# EAGLE schematic v2.0 (EAGLE 8.2.2)

## Sheet 1 of 8: Digital
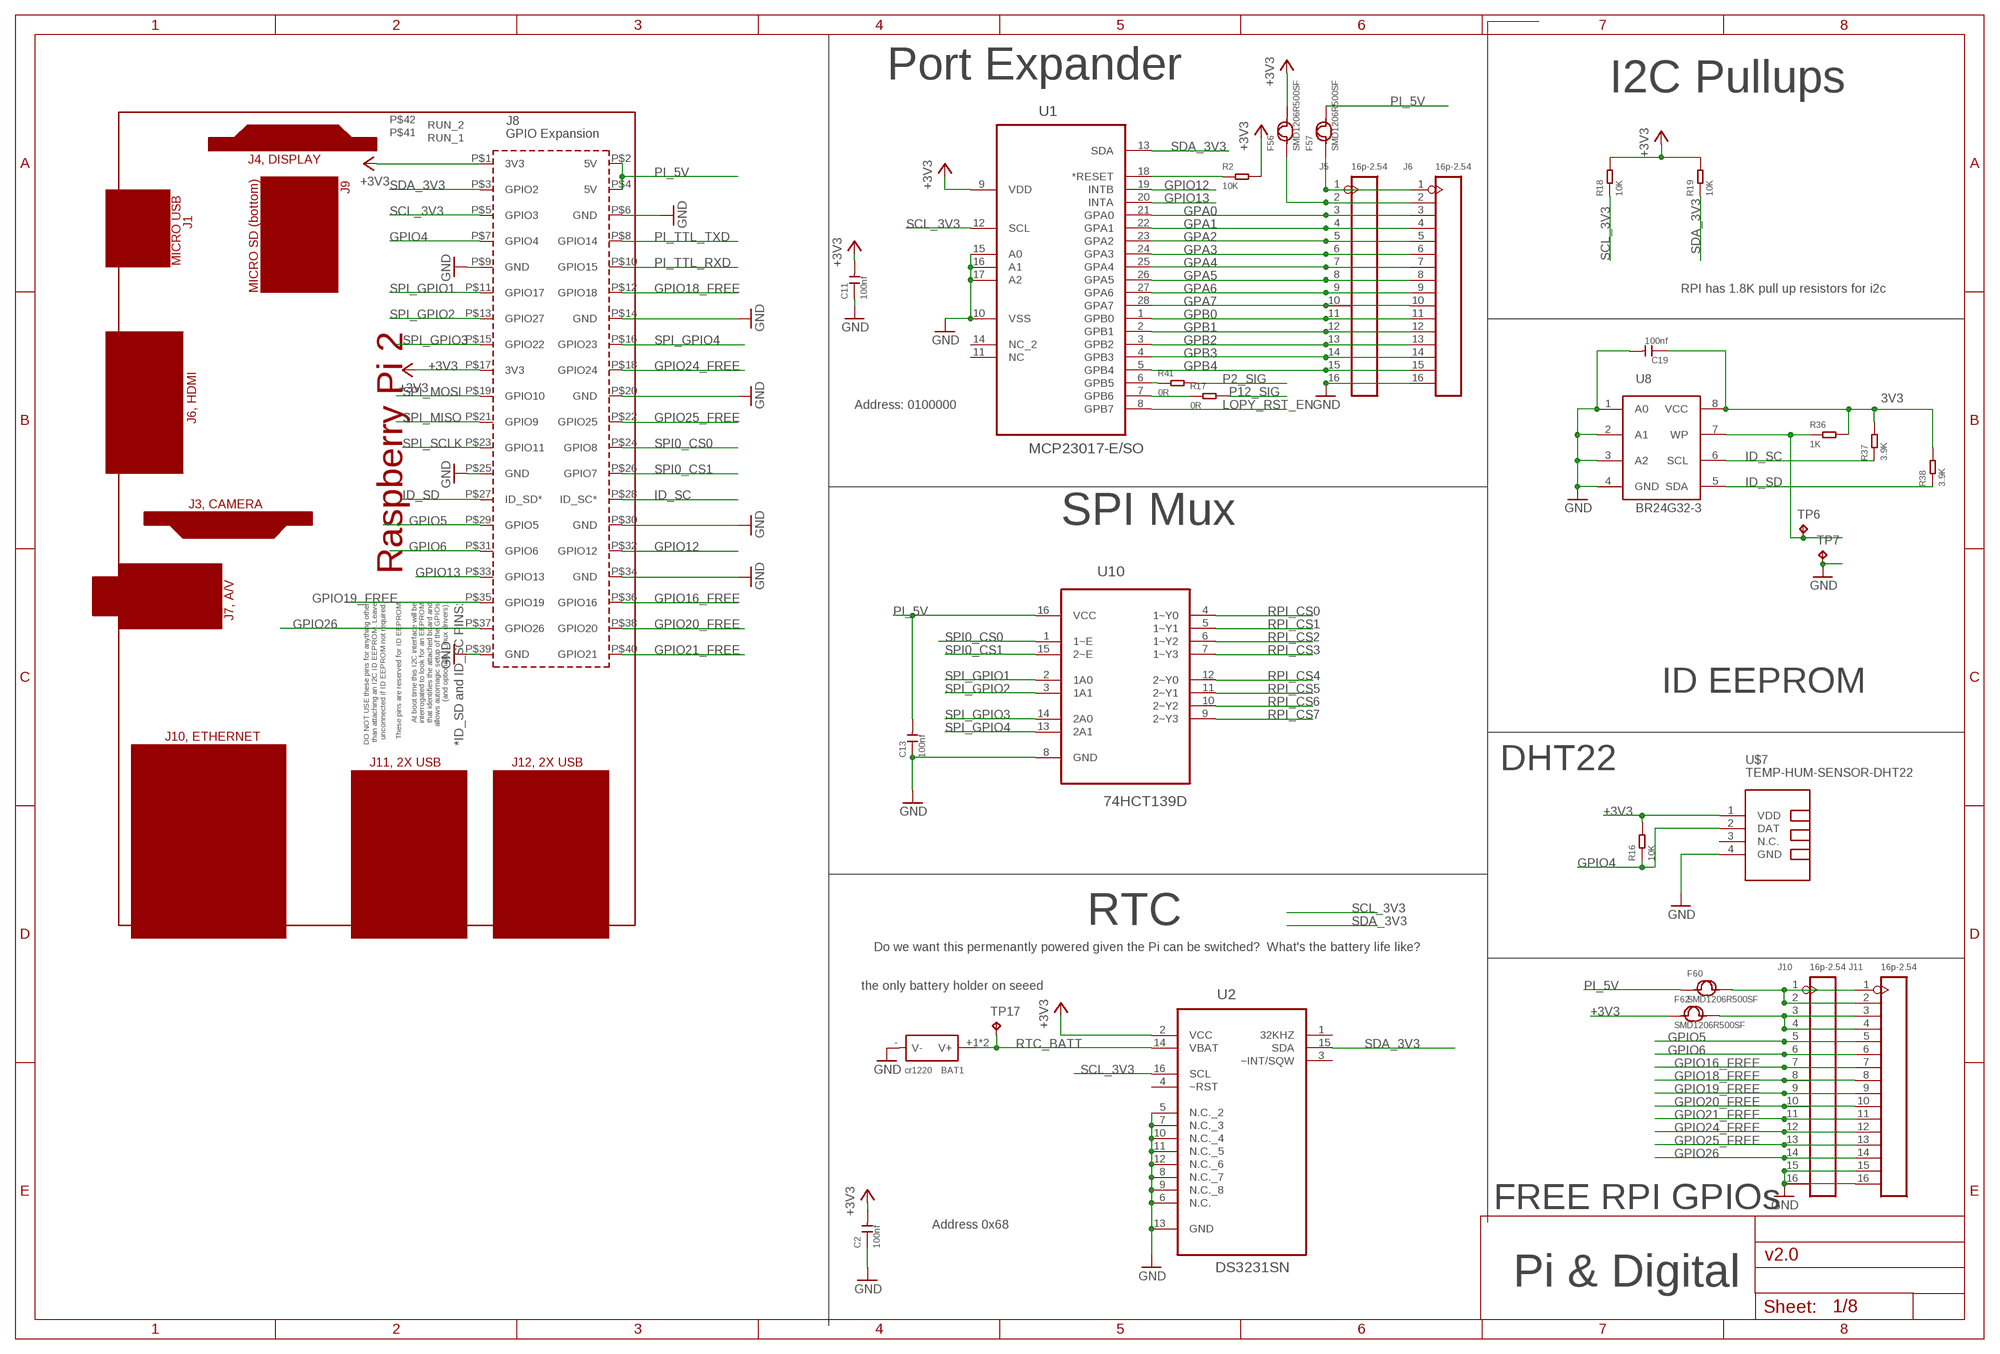
[diagram p0: schematic, sheet 1]

### Parts
BAT1  cr1220  DIP-BATTERY-CELL-HOLDER(1220)  [BAT2P-13.5-CR1220]
C2  100nf  CERAMIC-100NF-50V-10%-X7R(0603)  [C0603]
C11  100nf  CERAMIC-100NF-50V-10%-X7R(0603)  [C0603]
C13  100nf  CERAMIC-100NF-50V-10%-X7R(0603)  [C0603]
C19  100nf  CERAMIC-100NF-50V-10%-X7R(0603)  [C0603]
F56  SMD1206R500SF  SMD-PPTC-500MA(1206)  [F1206]
F57  SMD1206R500SF  SMD-PPTC-500MA(1206)  [F1206]
F60  SMD1206R500SF  SMD-PPTC-500MA(1206)  [F1206]
F62  SMD1206R500SF  SMD-PPTC-500MA(1206)  [F1206]
J5  16p-2.54  DIP-BLACK-MALE-HEADER-VERT(16P-2.54)  [H16-2.54]
J6  16p-2.54  DIP-BLACK-MALE-HEADER-VERT(16P-2.54)  [H16-2.54]
J10  16p-2.54  DIP-BLACK-MALE-HEADER-VERT(16P-2.54)  [H16-2.54]
J11  16p-2.54  DIP-BLACK-MALE-HEADER-VERT(16P-2.54)  [H16-2.54]
PCB1  RPI2  [RPI2]
R2  10K  SMD-RES-10K-1%-1/10W(0603)  [R0603]
R16  10K  SMD-RES-10K-1%-1/10W(0603)  [R0603]
R17  0R  SMD-RES-0R-5%-1/10W(0603)  [R0603]
R18  10K  SMD-RES-10K-1%-1/10W(0603)  [R0603]
R19  10K  SMD-RES-10K-1%-1/10W(0603)  [R0603]
R36  1K  SMD-RES-1K-1%-1/10W(0603)  [R0603]
R37  3.9K  SMD-RES-3.9K-5%-1/10W(0603)  [R0603]
R38  3.9K  SMD-RES-3.9K-5%-1/10W(0603)  [R0603]
R41  0R  SMD-RES-0R-5%-1/10W(0603)  [R0603]
TP6  TPB2,54  [B2,54]
TP7  TPB2,54  [B2,54]
TP17  TPB2,54  [B2,54]
U1  MCP23017-E/SO  [SOIC127P1032X265-28N]
U2  DS3231SN  [SOIC127P1032X265-16N]
U8  BR24G32-3  [SOP8]
U10  74HCT139D  [SOIC127P600X175-16N]
U$7  TEMP-HUM-SENSOR-DHT22  [TEMP-HUM-SENSOR-DHT22]

### Nets
3V3: C19.1 R36.2 R37.2 R38.2 U8.8(VCC)
+3V3: C2.2 C11.2 F56.2 F62.1 PCB1.P$1(3V3) PCB1.P$17(3V3) R2.2 R16.2 R18.2 R19.2 U1.9(VDD) U2.2(VCC) U$7.1(VDD) ; also sheet 3,5,6
EEPROM_WP: R36.1 TP6.TP U8.7(WP)
EXP_3V3: F56.1 J5.2 J6.2
EXP_5V: F57.1 J5.1 J6.1
GND: BAT1.-(V-) C2.1 C11.1 C13.1 C19.2 J5.16 J6.16 J10.15 J10.16 J11.15 J11.16 PCB1.P$6(GND) PCB1.P$9(GND) PCB1.P$14(GND) PCB1.P$20(GND) PCB1.P$25(GND) PCB1.P$30(GND) PCB1.P$34(GND) PCB1.P$39(GND) TP7.TP U1.10(VSS) U1.15(A0) U1.16(A1) U1.17(A2) U2.5(N.C._2) U2.6(N.C.) U2.7(N.C._3) U2.8(N.C._7) U2.9(N.C._8) U2.10(N.C._4) U2.11(N.C._5) U2.12(N.C._6) U2.13(GND) U8.1(A0) U8.2(A1) U8.3(A2) U8.4(GND) U10.8(GND) U$7.4(GND) ; also sheet 2,3,5,6,7,8
GPA0: J5.3 J6.3 U1.21(GPA0)
GPA1: J5.4 J6.4 U1.22(GPA1)
GPA2: J5.5 J6.5 U1.23(GPA2)
GPA3: J5.6 J6.6 U1.24(GPA3)
GPA4: J5.7 J6.7 U1.25(GPA4)
GPA5: J5.8 J6.8 U1.26(GPA5)
GPA6: J5.9 J6.9 U1.27(GPA6)
GPA7: J5.10 J6.10 U1.28(GPA7)
GPB0: J5.11 J6.11 U1.1(GPB0)
GPB1: J5.12 J6.12 U1.2(GPB1)
GPB2: J5.13 J6.13 U1.3(GPB2)
GPB3: J5.14 J6.14 U1.4(GPB3)
GPB4: J5.15 J6.15 U1.5(GPB4)
GPIO4: PCB1.P$7(GPIO4) R16.1 U$7.2(DAT)
GPIO5: J10.5 J11.5 PCB1.P$29(GPIO5)
GPIO6: J10.6 J11.6 PCB1.P$31(GPIO6)
GPIO12: PCB1.P$32(GPIO12) U1.19(INTB)
GPIO13: PCB1.P$33(GPIO13) U1.20(INTA)
GPIO16_FREE: J10.7 J11.7 PCB1.P$36(GPIO16)
GPIO18_FREE: J10.8 J11.8 PCB1.P$12(GPIO18)
GPIO19_FREE: J10.9 J11.9 PCB1.P$35(GPIO19)
GPIO20_FREE: J10.10 J11.10 PCB1.P$38(GPIO20)
GPIO21_FREE: J10.11 J11.11 PCB1.P$40(GPIO21)
GPIO24_FREE: J10.12 J11.12 PCB1.P$18(GPIO24)
GPIO25_FREE: J10.13 J11.13 PCB1.P$22(GPIO25)
GPIO26: J10.14 J11.14 PCB1.P$37(GPIO26)
GPIO_5V_FUSED: F60.2 J10.1 J10.2 J11.1 J11.2
ID_SC: PCB1.P$28(ID_SC*) R37.1 U8.6(SCL)
ID_SD: PCB1.P$27(ID_SD*) R38.1 U8.5(SDA)
LOPY_RST_EN: U1.8(GPB7) ; also sheet 2
N$1: R2.1 U1.18(*RESET)
N$19: F62.2 J10.3 J10.4 J11.3 J11.4
P2_EN: R41.1 U1.6(GPB5)
P2_SIG: R41.2 ; also sheet 2
P12_SIG: R17.2 ; also sheet 2
PI12_EN: R17.1 U1.7(GPB6)
PI_5V: C13.2 F57.2 F60.1 PCB1.P$2(5V) PCB1.P$4(5V) U10.16(VCC) ; also sheet 3,5,6
PI_TTL_RXD: PCB1.P$10(GPIO15) ; also sheet 2,6
PI_TTL_TXD: PCB1.P$8(GPIO14) ; also sheet 2,6
RPI_CS0: U10.4(1~Y0) ; also sheet 6
RPI_CS1: U10.5(1~Y1) ; also sheet 6
RPI_CS2: U10.6(1~Y2) ; also sheet 6
RPI_CS3: U10.7(1~Y3) ; also sheet 6
RPI_CS4: U10.12(2~Y0) ; also sheet 6
RPI_CS5: U10.11(2~Y1) ; also sheet 6
RPI_CS6: U10.10(2~Y2) ; also sheet 6
RPI_CS7: U10.9(2~Y3) ; also sheet 6
RTC_BATT: BAT1.+1(V+) BAT1.+2(V+) TP17.TP U2.14(VBAT)
SCL_3V3: PCB1.P$5(GPIO3) R18.1 U1.12(SCL) U2.16(SCL) ; also sheet 4,6
SDA_3V3: PCB1.P$3(GPIO2) R19.1 U1.13(SDA) U2.15(SDA) ; also sheet 4,6
SPI0_CS0: PCB1.P$24(GPIO8) U10.1(1~E)
SPI0_CS1: PCB1.P$26(GPIO7) U10.15(2~E)
SPI_GPIO1: PCB1.P$11(GPIO17) U10.2(1A0)
SPI_GPIO2: PCB1.P$13(GPIO27) U10.3(1A1)
SPI_GPIO3: PCB1.P$15(GPIO22) U10.14(2A0)
SPI_GPIO4: PCB1.P$16(GPIO23) U10.13(2A1)
SPI_MISO: PCB1.P$21(GPIO9) ; also sheet 6
SPI_MOSI: PCB1.P$19(GPIO10) ; also sheet 6
SPI_SCLK: PCB1.P$23(GPIO11) ; also sheet 6
Unconnected: PCB1.P$41(RUN_1) PCB1.P$42(RUN_2) U1.11(NC) U1.14(NC_2) U2.1(32KHZ) U2.3(~INT/SQW) U2.4(~RST) U$7.3(N.C.)

### Notes on the sheet
- Port Expander | I2C Pullups
- RPI has 1.8K pull up resistors for i2c
- Address: 0100000
- SPI Mux
- ID EEPROM
- DHT22
- RTC
- Do we want this permenantly powered given the Pi can be switched?  What's the battery life like?
- the only battery holder on seeed
- FREE RPI GPIOs
- Address 0x68
- Pi & Digital

## Sheet 2 of 8: PyCom
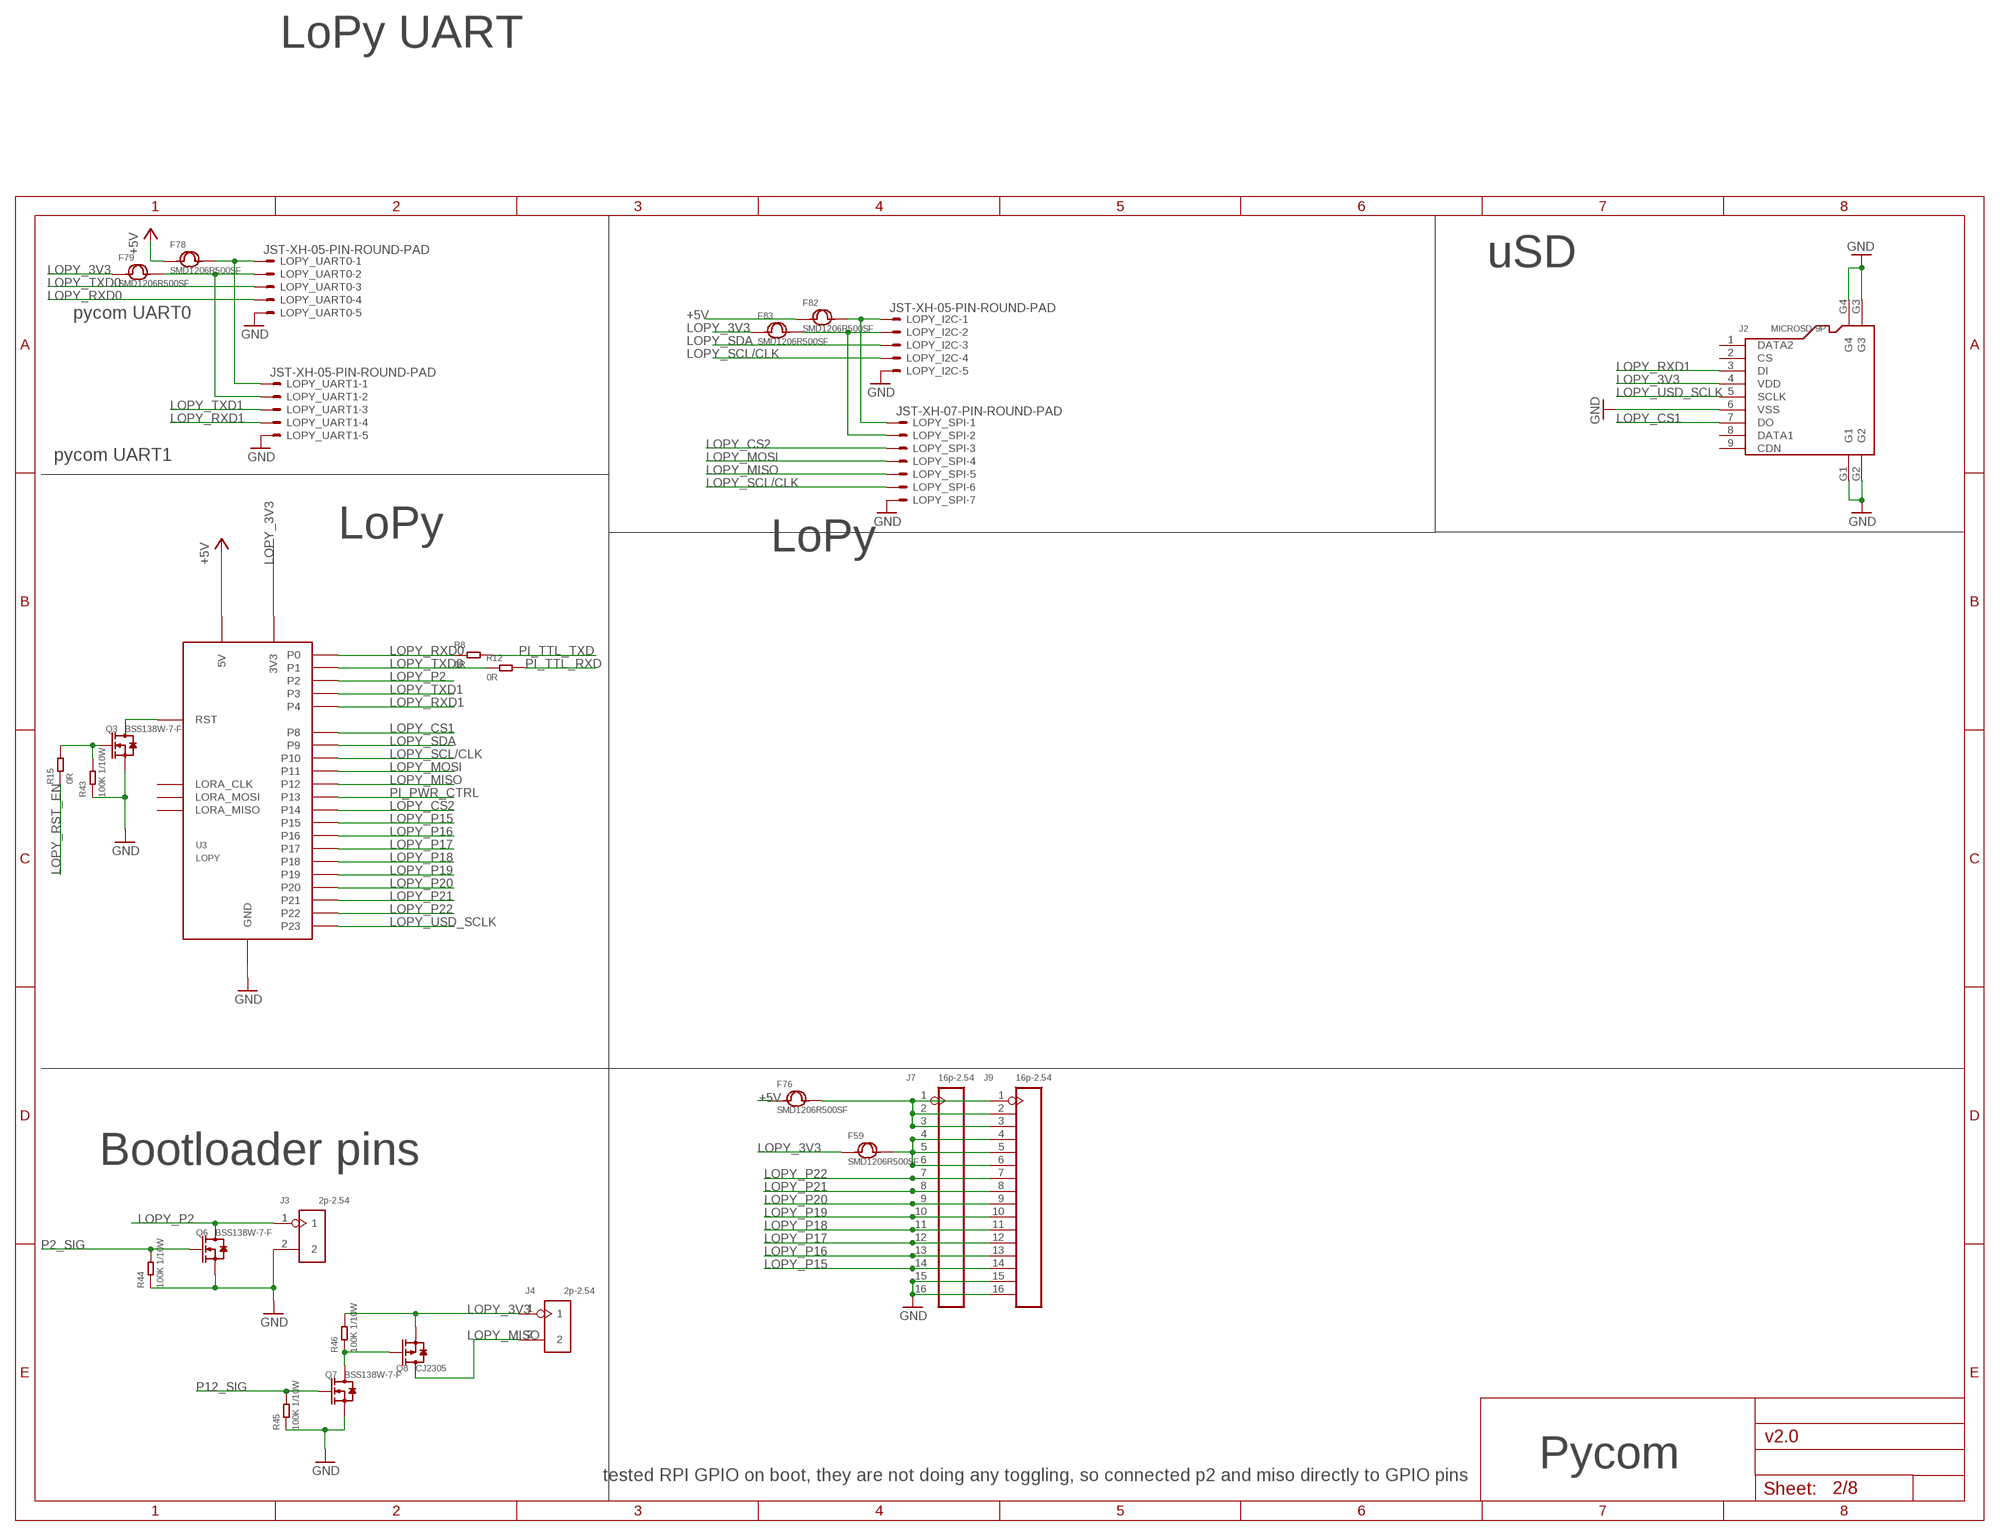
[diagram p1: schematic, sheet 2]

### Parts
F59  SMD1206R500SF  SMD-PPTC-500MA(1206)  [F1206]
F76  SMD1206R500SF  SMD-PPTC-500MA(1206)  [F1206]
F78  SMD1206R500SF  SMD-PPTC-500MA(1206)  [F1206]
F79  SMD1206R500SF  SMD-PPTC-500MA(1206)  [F1206]
F82  SMD1206R500SF  SMD-PPTC-500MA(1206)  [F1206]
F83  SMD1206R500SF  SMD-PPTC-500MA(1206)  [F1206]
J2  MICROSD-9P  MICRO-SD-CARD-HOLDER-9P  [MICRO-SD9+4P-SMD-16.1X14.5X1.85MM]
J3  2p-2.54  DIP-BLACK-MALE-HEADER-VERT(2P-2.54)  [H2-2.54]
J4  2p-2.54  DIP-BLACK-MALE-HEADER-VERT(2P-2.54)  [H2-2.54]
J7  16p-2.54  DIP-BLACK-MALE-HEADER-VERT(16P-2.54)  [H16-2.54]
J9  16p-2.54  DIP-BLACK-MALE-HEADER-VERT(16P-2.54)  [H16-2.54]
LOPY_I2C  JST-XH-05-PIN-ROUND-PAD  [JST-XH-05-PACKAGE-ROUND-PAD]
LOPY_SPI  JST-XH-07-PIN-ROUND-PAD  [JST-XH-07-PACKAGE-ROUND-PAD]
LOPY_UART0  JST-XH-05-PIN-ROUND-PAD  [JST-XH-05-PACKAGE-ROUND-PAD]
LOPY_UART1  JST-XH-05-PIN-ROUND-PAD  [JST-XH-05-PACKAGE-ROUND-PAD]
Q3  BSS138W-7-F  SMD-MOSFET-N-CH-50V-200MA-BSS138W-7-F(SOT-23)  [SOT-23]
Q6  BSS138W-7-F  SMD-MOSFET-N-CH-50V-200MA-BSS138W-7-F(SOT-23)  [SOT-23]
Q7  BSS138W-7-F  SMD-MOSFET-N-CH-50V-200MA-BSS138W-7-F(SOT-23)  [SOT-23]
Q8  CJ2305  SMD-MOSFET-P-CH-8V-4.1A-CJ2305(SOT-23)  [SOT-23]
R8  0R  SMD-RES-0R-5%-1/10W(0603)  [R0603]
R12  0R  SMD-RES-0R-5%-1/10W(0603)  [R0603]
R15  0R  SMD-RES-0R-5%-1/10W(0603)  [R0603]
R43  100K 1/10W  SMD-RES-100K-5%-1/10W(0603)  [R0603]
R44  100K 1/10W  SMD-RES-100K-5%-1/10W(0603)  [R0603]
R45  100K 1/10W  SMD-RES-100K-5%-1/10W(0603)  [R0603]
R46  100K 1/10W  SMD-RES-100K-5%-1/10W(0603)  [R0603]
U3  LOPY  [LOPY]

### Nets
+5V: F76.1 F78.1 F82.1 U3.P$28(5V) ; also sheet 3,5
GND: J2.6(VSS) J2.G1 J2.G2 J2.G3 J2.G4 J3.2 J7.15 J7.16 J9.15 J9.16 LOPY_I2C.5 LOPY_SPI.7 LOPY_UART0.5 LOPY_UART1.5 Q3.2(S) Q6.2(S) Q7.2(S) R43.1 R44.1 R45.1 U3.P$27(GND) ; also sheet 1,3,5,6,7,8
LOPY_3V3: F59.1 F79.1 F83.1 J2.4(VDD) J4.1 Q8.2(S) R46.2 U3.P$26(3V3) ; also sheet 5
LOPY_3V3_FUSED: F59.2 J7.4 J7.5 J7.6 J9.4 J9.5 J9.6
LOPY_5V_FUSED: F76.2 J7.1 J7.2 J7.3 J9.1 J9.2 J9.3
LOPY_CS1: J2.7(DO) U3.P$10(P8)
LOPY_CS2: LOPY_SPI.3 U3.P$16(P14)
LOPY_I2C_3V3_PROTECTED: F83.2 LOPY_I2C.2 LOPY_SPI.2
LOPY_MISO: J4.2 LOPY_SPI.5 Q8.3(D) U3.P$14(P12)
LOPY_MOSI: LOPY_SPI.4 U3.P$13(P11)
LOPY_P2: J3.1 Q6.3(D) U3.P$4(P2)
LOPY_P15: J7.14 J9.14 U3.P$17(P15)
LOPY_P16: J7.13 J9.13 U3.P$18(P16)
LOPY_P17: J7.12 J9.12 U3.P$19(P17)
LOPY_P18: J7.11 J9.11 U3.P$20(P18)
LOPY_P19: J7.10 J9.10 U3.P$21(P19)
LOPY_P20: J7.9 J9.9 U3.P$22(P20)
LOPY_P21: J7.8 J9.8 U3.P$23(P21)
LOPY_P22: J7.7 J9.7 U3.P$24(P22)
LOPY_RST: Q3.3(D) U3.P$1(RST)
LOPY_RST_EN: R15.1 ; also sheet 1
LOPY_RXD0: LOPY_UART0.4 R8.1 U3.P$2(P0)
LOPY_RXD1: J2.3(DI) LOPY_UART1.4 U3.P$6(P4)
LOPY_SCL/CLK: LOPY_I2C.4 LOPY_SPI.6 U3.P$12(P10)
LOPY_SDA: LOPY_I2C.3 U3.P$11(P9)
LOPY_TXD0: LOPY_UART0.3 R12.1 U3.P$3(P1)
LOPY_TXD1: LOPY_UART1.3 U3.P$5(P3)
LOPY_UART0_3V3_PROTECTED: F79.2 LOPY_UART0.2 LOPY_UART1.2
LOPY_UART0_5V_PROTECTED: F78.2 LOPY_UART0.1 LOPY_UART1.1
LOPY_USD_SCLK: J2.5(SCLK) U3.P$25(P23)
N$4: F82.2 LOPY_I2C.1 LOPY_SPI.1
N$12: Q3.1(G) R15.2 R43.2
N$13: Q7.3(D) Q8.1(G) R46.1
P2_SIG: Q6.1(G) R44.2 ; also sheet 1
P12_SIG: Q7.1(G) R45.2 ; also sheet 1
PI_PWR_CTRL: U3.P$15(P13) ; also sheet 3,5
PI_TTL_RXD: R12.2 ; also sheet 1,6
PI_TTL_TXD: R8.2 ; also sheet 1,6
Unconnected: J2.1(DATA2) J2.2(CS) J2.8(DATA1) J2.9(CDN) U3.P$7(LORA_CLK) U3.P$8(LORA_MOSI) U3.P$9(LORA_MISO)

### Notes on the sheet
- LoPy UART
- uSD
- pycom UART0
- pycom UART1
- LoPy | LoPy
- Bootloader pins
- Pycom
- tested RPI GPIO on boot, they are not doing any toggling, so connected p2 and miso directly to GPIO pins

## Sheet 3 of 8: PSU
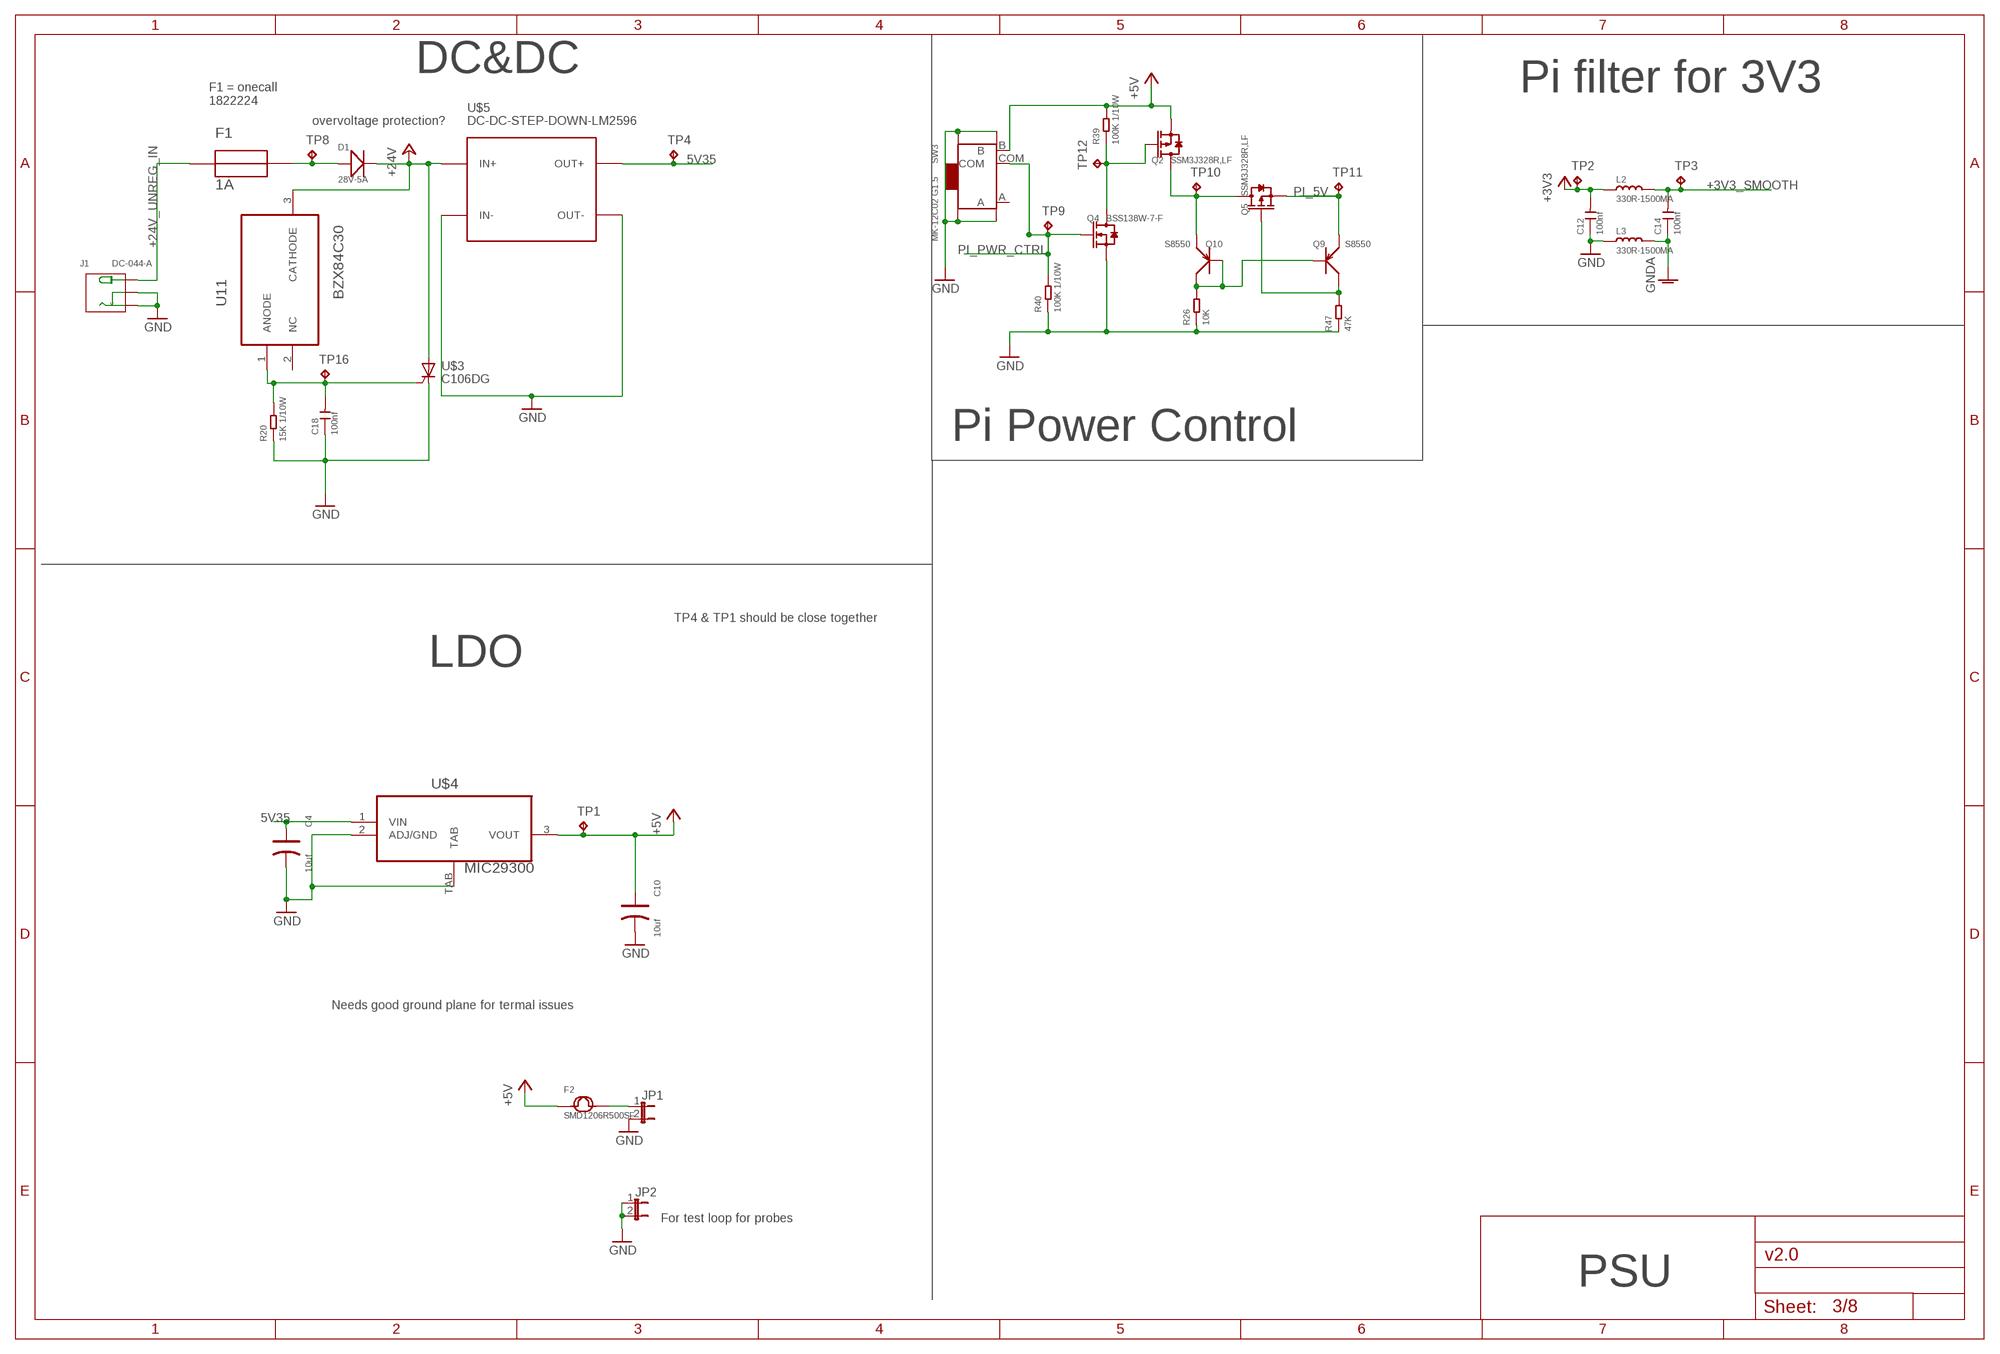
[diagram p2: schematic, sheet 3]

### Parts
C4  10uf  TANTALUM-SMD-10UF-10V-10%(AVX-A)  [AVX-A]
C10  10uf  TANTALUM-SMD-10UF-10V-10%(AVX-A)  [AVX-A]
C12  100nf  CERAMIC-100NF-50V-10%-X7R(0603)  [C0603]
C14  100nf  CERAMIC-100NF-50V-10%-X7R(0603)  [C0603]
C18  100nf  CERAMIC-100NF-50V-10%-X7R(0603)  [C0603]
D1  28V-5A  SMD-DIODE-SCHOTTKY-28V-5A(DO-214AA)  [DO-214AA]
F1  1A  FUSE-2920  [2920]
F2  SMD1206R500SF  SMD-PPTC-500MA(1206)  [F1206]
J1  DC-044-A  JACK-DC-044-A  [DCJ3P-11.6X9.6X7.0MM]
JP1  JP1E  [JP1]
JP2  JP1E  [JP1]
L2  330R-1500MA  SMD-FERRITE-BEAD-330R-1500MA(0805)'0805'  [L0805]
L3  330R-1500MA  SMD-FERRITE-BEAD-330R-1500MA(0805)'0805'  [L0805]
Q2  SSM3J328R,LF  SMD-MOSFET-P-CH-20V-6A-SSM3J328R(SOT-23)  [SOT-23]
Q4  BSS138W-7-F  SMD-MOSFET-N-CH-50V-200MA-BSS138W-7-F(SOT-23)  [SOT-23]
Q5  SSM3J328R,LF  SMD-MOSFET-P-CH-20V-6A-SSM3J328R(SOT-23)  [SOT-23]
Q9  S8550  SMD-TRANSISTORS-PNP-25V-500MA-S8550(SOT-23)  [SOT-23]
Q10  S8550  SMD-TRANSISTORS-PNP-25V-500MA-S8550(SOT-23)  [SOT-23]
R20  15K 1/10W  SMD-RES-15K-1%-1/10W(0603)  [R0603]
R26  10K  SMD-RES-10K-1%-1/10W(0603)  [R0603]
R39  100K 1/10W  SMD-RES-100K-5%-1/10W(0603)  [R0603]
R40  100K 1/10W  SMD-RES-100K-5%-1/10W(0603)  [R0603]
R47  47K  SMD-RES-47K-5%-1/10W(0603)  [R0603]
SW3  MK-12C02 G1.5  SMD-TOGGLE-SWITCH-ON-ON(3+4P-6.7X2.7MM)  [SW7-SMD-L6.7X2.7X3.2MM]
TP1  TPB2,54  [B2,54]
TP2  TPB2,54  [B2,54]
TP3  TPB2,54  [B2,54]
TP4  TPB2,54  [B2,54]
TP8  TPB2,54  [B2,54]
TP9  TPB2,54  [B2,54]
TP10  TPB2,54  [B2,54]
TP11  TPB2,54  [B2,54]
TP12  TPB2,54  [B2,54]
TP16  TPB2,54  [B2,54]
U11  BZX84C30  [SOT91P240X110-3N]
U$3  C106DG  [TO-225AA]
U$4  MIC29300  [TO-263]
U$5  DC-DC-STEP-DOWN-LM2596  [DC-DC-STEP-DOWN-LM2596]

### Nets
5V35: C4.+ TP4.TP U$4.1(VIN) U$5.OUT+ ; also sheet 5
+3V3: C12.2 L2.1 TP2.TP ; also sheet 1,5,6
+3V3_SMOOTH: C14.2 L2.2 TP3.TP ; also sheet 4,5,6
+5V: C10.+ F2.1 Q2.2(S) R39.2 SW3.B TP1.TP U$4.3(VOUT) ; also sheet 2,5
+24V: D1.- U11.3(CATHODE) U$3.2(A) U$5.IN+ ; also sheet 5
+24V_UNREG_IN: F1.1 J1.+
GND: C4.- C10.- C12.1 C18.1 J1.- J1.CDN JP1.2 JP2.1 JP2.2 L3.1 Q4.2(S) R20.1 R26.1 R40.1 R47.1 SW3.SS1 SW3.SS2 SW3.SS3 SW3.SS4 U$3.1(C) U$4.2(ADJ/GND) U$4.TAB U$5.IN- U$5.OUT- ; also sheet 1,2,5,6,7,8
GNDA: C14.1 L3.2 ; also sheet 4,6
N$2: F2.2 JP1.1
N$14: Q9.1(B) Q10.1(B) Q10.3(C) R26.2
N$15: Q5.1(G) Q9.3(C) R47.2
N$68: D1.+ F1.2 TP8.TP
N$80: C18.2 R20.2 TP16.TP U11.1(ANODE) U$3.3(G1)
N$122: Q2.3(D) Q5.3(D) Q10.2(E) TP10.TP
N$123: Q2.1(G) Q4.3(D) R39.1 TP12.TP
PI_5V: Q5.2(S) Q9.2(E) TP11.TP ; also sheet 1,5,6
PI_PWR_CTRL: Q4.1(G) R40.2 SW3.COM TP9.TP ; also sheet 2,5
Unconnected: SW3.A U11.2(NC)

### Notes on the sheet
- DC&DC
- Pi filter for 3V3
- F1 = onecall 
  1822224
- overvoltage protection?
- Pi Power Control
- TP4 & TP1 should be close together
- LDO
- Needs good ground plane for termal issues
- For test loop for probes
- PSU

## Sheet 4 of 8: ADC
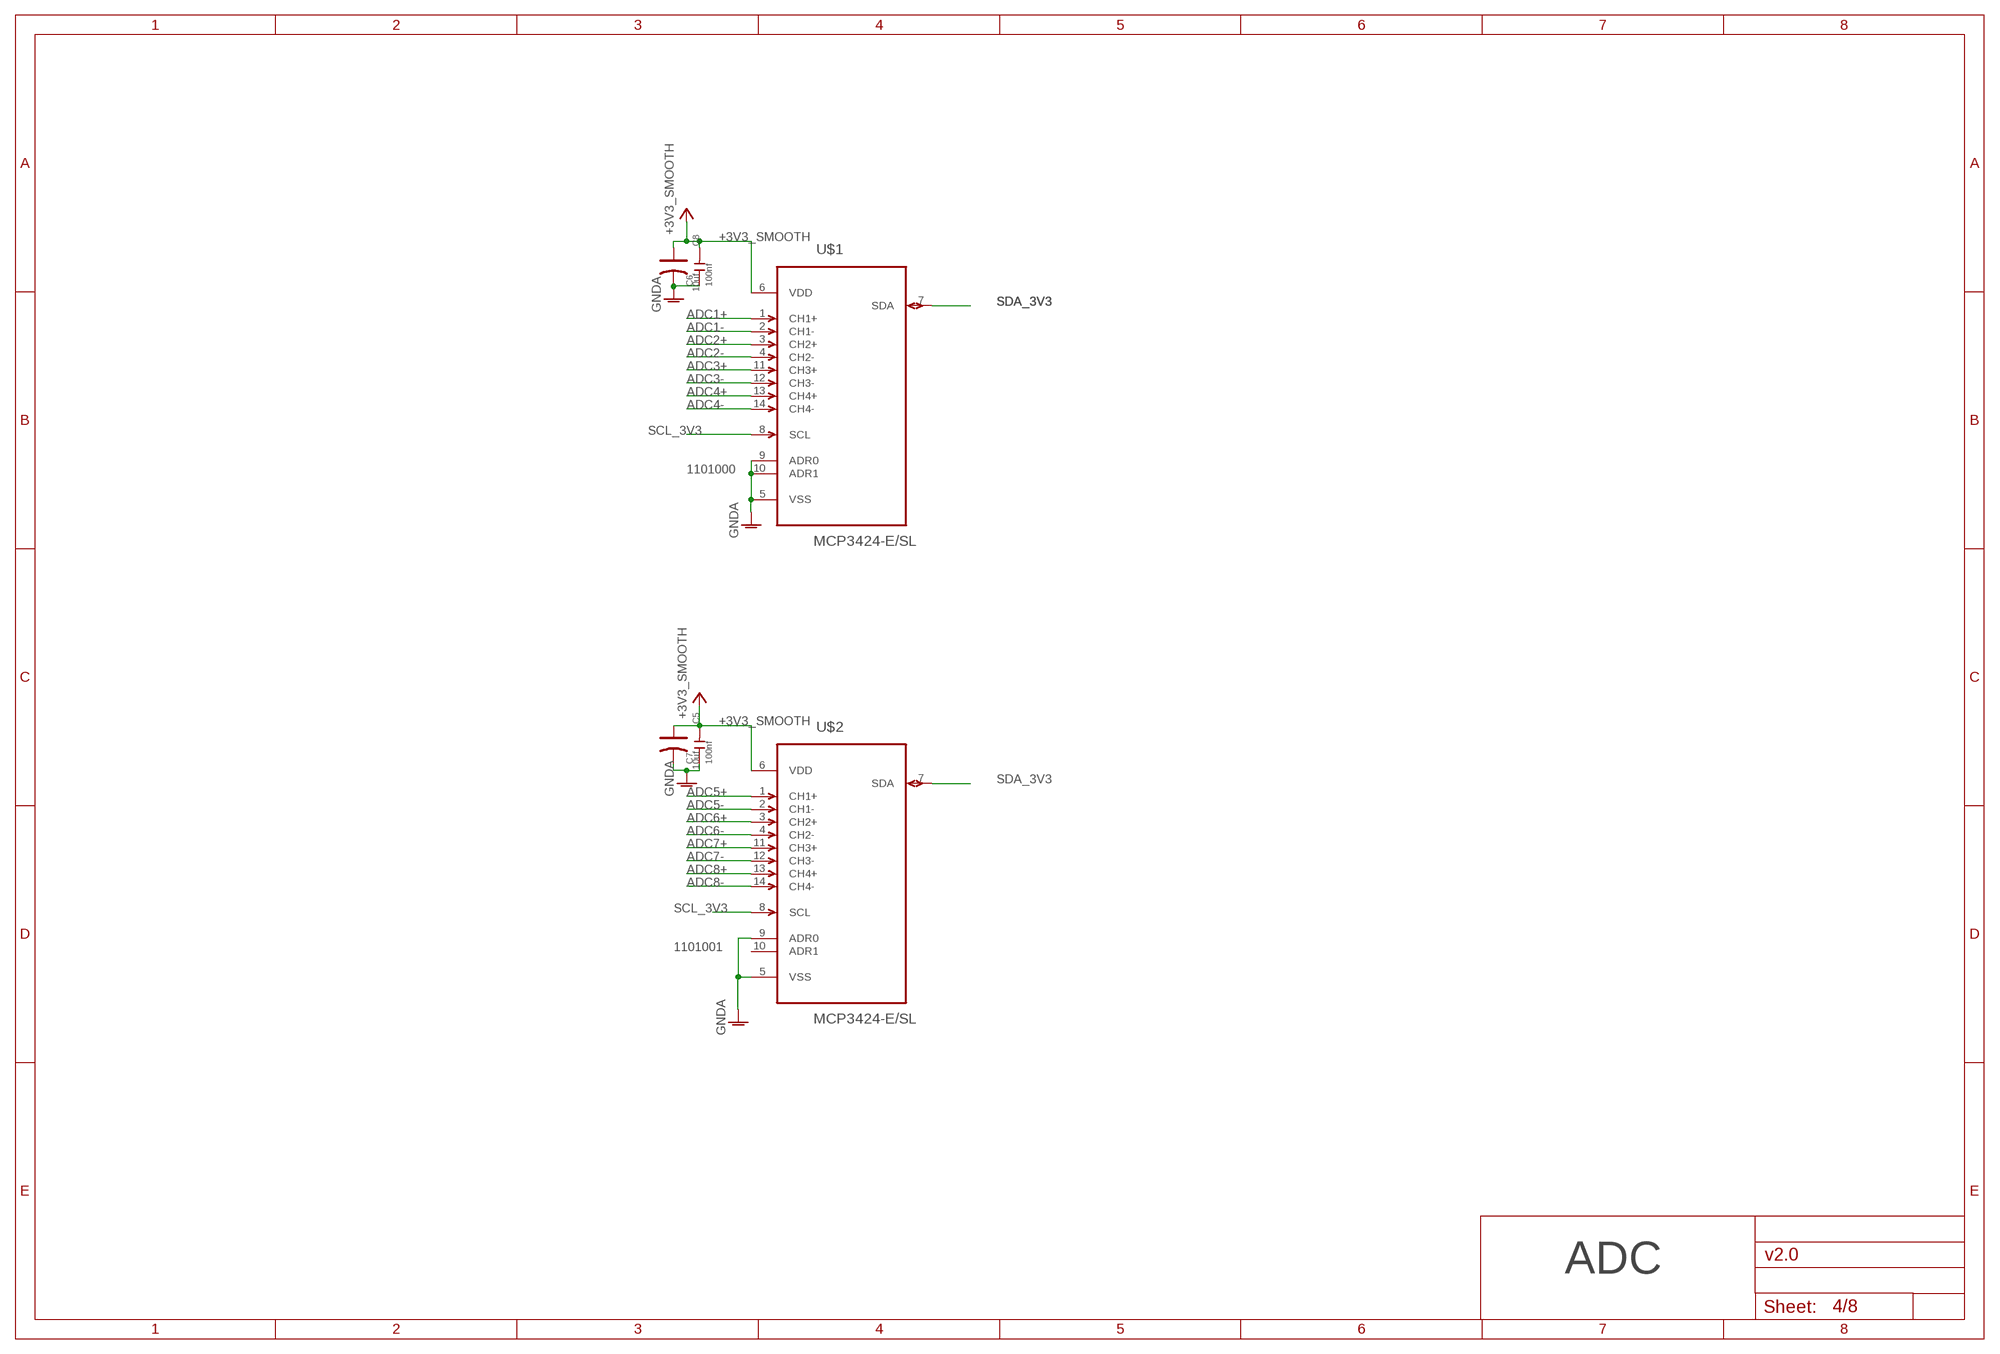
[diagram p3: schematic, sheet 4]

### Parts
C5  10uf  TANTALUM-SMD-10UF-10V-10%(AVX-A)  [AVX-A]
C6  100nf  CERAMIC-100NF-50V-10%-X7R(0603)  [C0603]
C7  100nf  CERAMIC-100NF-50V-10%-X7R(0603)  [C0603]
C8  10uf  TANTALUM-SMD-10UF-10V-10%(AVX-A)  [AVX-A]
U$1  MCP3424-E/SL  [SOIC127P600X175-14N]
U$2  MCP3424-E/SL  [SOIC127P600X175-14N]

### Nets
+3V3_SMOOTH: C5.+ C6.2 C7.2 C8.+ U$1.6(VDD) U$2.6(VDD) ; also sheet 3,5,6
ADC1+: U$1.1(CH1+) ; also sheet 6
ADC1-: U$1.2(CH1-) ; also sheet 6
ADC2+: U$1.3(CH2+) ; also sheet 6
ADC2-: U$1.4(CH2-) ; also sheet 6
ADC3+: U$1.11(CH3+) ; also sheet 6
ADC3-: U$1.12(CH3-) ; also sheet 6
ADC4+: U$1.13(CH4+) ; also sheet 6
ADC4-: U$1.14(CH4-) ; also sheet 6
ADC5+: U$2.1(CH1+) ; also sheet 6
ADC5-: U$2.2(CH1-) ; also sheet 6
ADC6+: U$2.3(CH2+) ; also sheet 6
ADC6-: U$2.4(CH2-) ; also sheet 6
ADC7+: U$2.11(CH3+) ; also sheet 6
ADC7-: U$2.12(CH3-) ; also sheet 6
ADC8+: U$2.13(CH4+) ; also sheet 6
ADC8-: U$2.14(CH4-) ; also sheet 6
GNDA: C5.- C6.1 C7.1 C8.- U$1.5(VSS) U$1.9(ADR0) U$1.10(ADR1) U$2.5(VSS) U$2.9(ADR0) ; also sheet 3,6
SCL_3V3: U$1.8(SCL) U$2.8(SCL) ; also sheet 1,6
SDA_3V3: U$1.7(SDA) U$2.7(SDA) ; also sheet 1,6
Unconnected: U$2.10(ADR1)

### Notes on the sheet
- 1101000
- 1101001
- ADC

## Sheet 5 of 8: LEDs
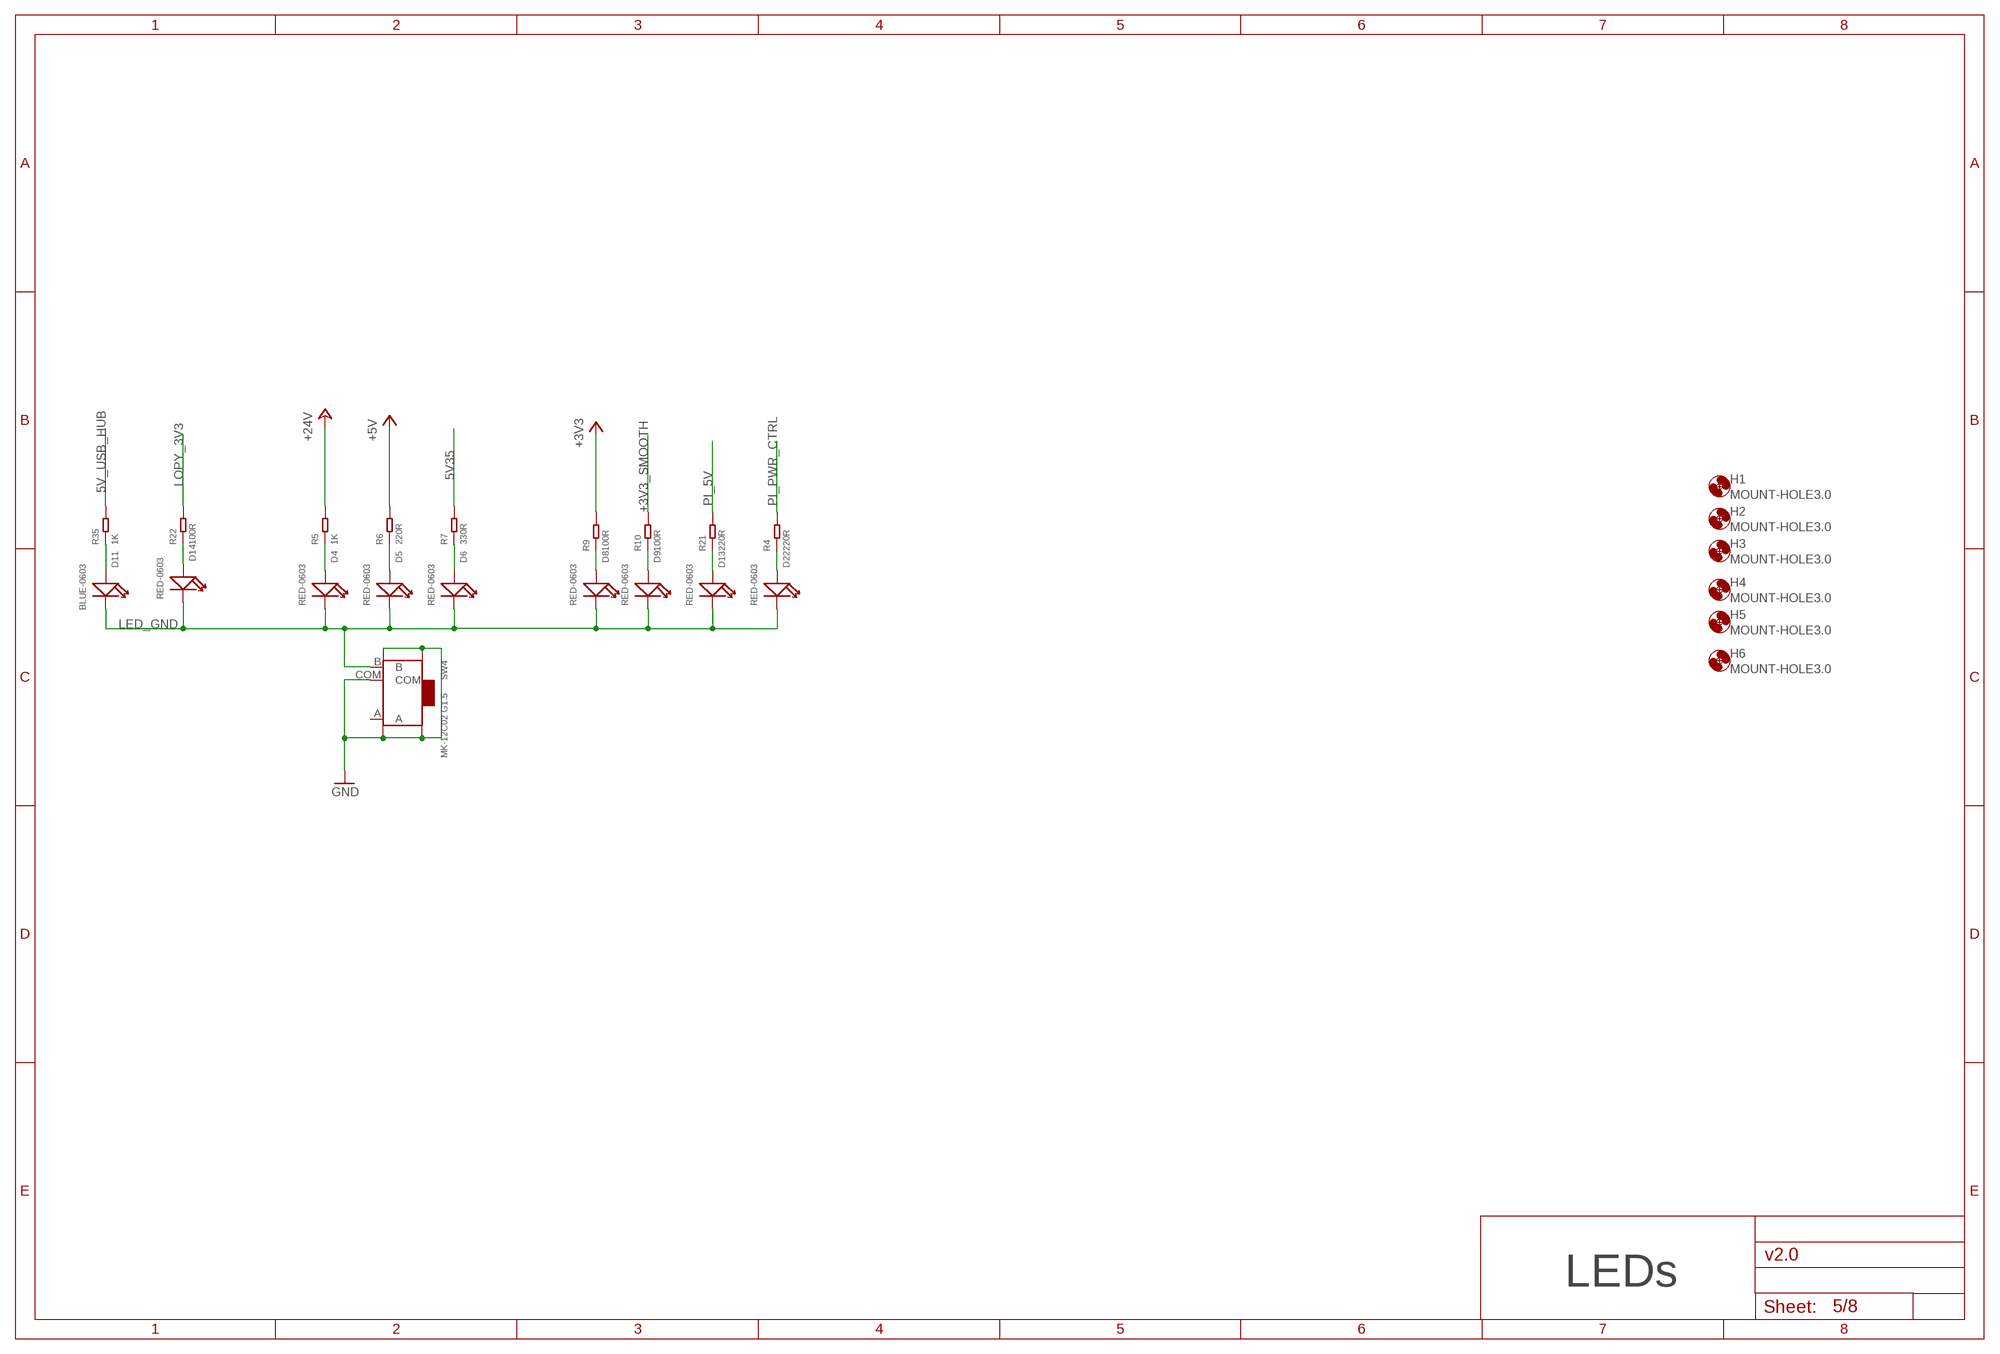
[diagram p4: schematic, sheet 5]

### Parts
D4  RED-0603  LED-SMD-RED-DIFFUSED(0603)  [LED-0603]
D5  RED-0603  LED-SMD-RED-DIFFUSED(0603)  [LED-0603]
D6  RED-0603  LED-SMD-RED-DIFFUSED(0603)  [LED-0603]
D8  RED-0603  LED-SMD-RED-DIFFUSED(0603)  [LED-0603]
D9  RED-0603  LED-SMD-RED-DIFFUSED(0603)  [LED-0603]
D11  BLUE-0603  SMD-LED-CLEAR-BLUE(0603)  [LED-0603]
D13  RED-0603  LED-SMD-RED-DIFFUSED(0603)  [LED-0603]
D14  RED-0603  LED-SMD-RED-DIFFUSED(0603)  [LED-0603]
D22  RED-0603  LED-SMD-RED-DIFFUSED(0603)  [LED-0603]
H1  MOUNT-HOLE3.0  [3,0]
H2  MOUNT-HOLE3.0  [3,0]
H3  MOUNT-HOLE3.0  [3,0]
H4  MOUNT-HOLE3.0  [3,0]
H5  MOUNT-HOLE3.0  [3,0]
H6  MOUNT-HOLE3.0  [3,0]
R4  220R  SMD-RES-220R-5%-1/10W(0603)  [R0603]
R5  1K  SMD-RES-1K-1%-1/10W(0603)  [R0603]
R6  220R  SMD-RES-220R-5%-1/10W(0603)  [R0603]
R7  330R  SMD-RES-330R-1%-1/10W(0603)  [R0603]
R9  100R  SMD-RES-100R-5%-1/10W(0603)  [R0603]
R10  100R  SMD-RES-100R-5%-1/10W(0603)  [R0603]
R21  220R  SMD-RES-220R-5%-1/10W(0603)  [R0603]
R22  100R  SMD-RES-100R-5%-1/10W(0603)  [R0603]
R35  1K  SMD-RES-1K-1%-1/10W(0603)  [R0603]
SW4  MK-12C02 G1.5  SMD-TOGGLE-SWITCH-ON-ON(3+4P-6.7X2.7MM)  [SW7-SMD-L6.7X2.7X3.2MM]

### Nets
5V35: R7.2 ; also sheet 3
5V_USB_HUB: R35.2 ; also sheet 7
+3V3: R9.2 ; also sheet 1,3,6
+3V3_SMOOTH: R10.2 ; also sheet 3,4,6
+5V: R6.2 ; also sheet 2,3
+24V: R5.2 ; also sheet 3
GND: SW4.COM SW4.SS1 SW4.SS2 SW4.SS3 SW4.SS4 ; also sheet 1,2,3,6,7,8
LED_GND: D4.- D5.- D6.- D8.- D9.- D11.- D13.- D14.- D22.- SW4.B ; also sheet 7
LOPY_3V3: R22.2 ; also sheet 2
N$5: D22.+ R4.1
N$29: D9.+ R10.1
N$30: D8.+ R9.1
N$32: D6.+ R7.1
N$33: D5.+ R6.1
N$34: D4.+ R5.1
N$61: D11.+ R35.1
N$82: D14.+ R22.1
N$87: D13.+ R21.1
PI_5V: R21.2 ; also sheet 1,3,6
PI_PWR_CTRL: R4.2 ; also sheet 2,3
Unconnected: SW4.A

### Notes on the sheet
- LEDs

## Sheet 6 of 8
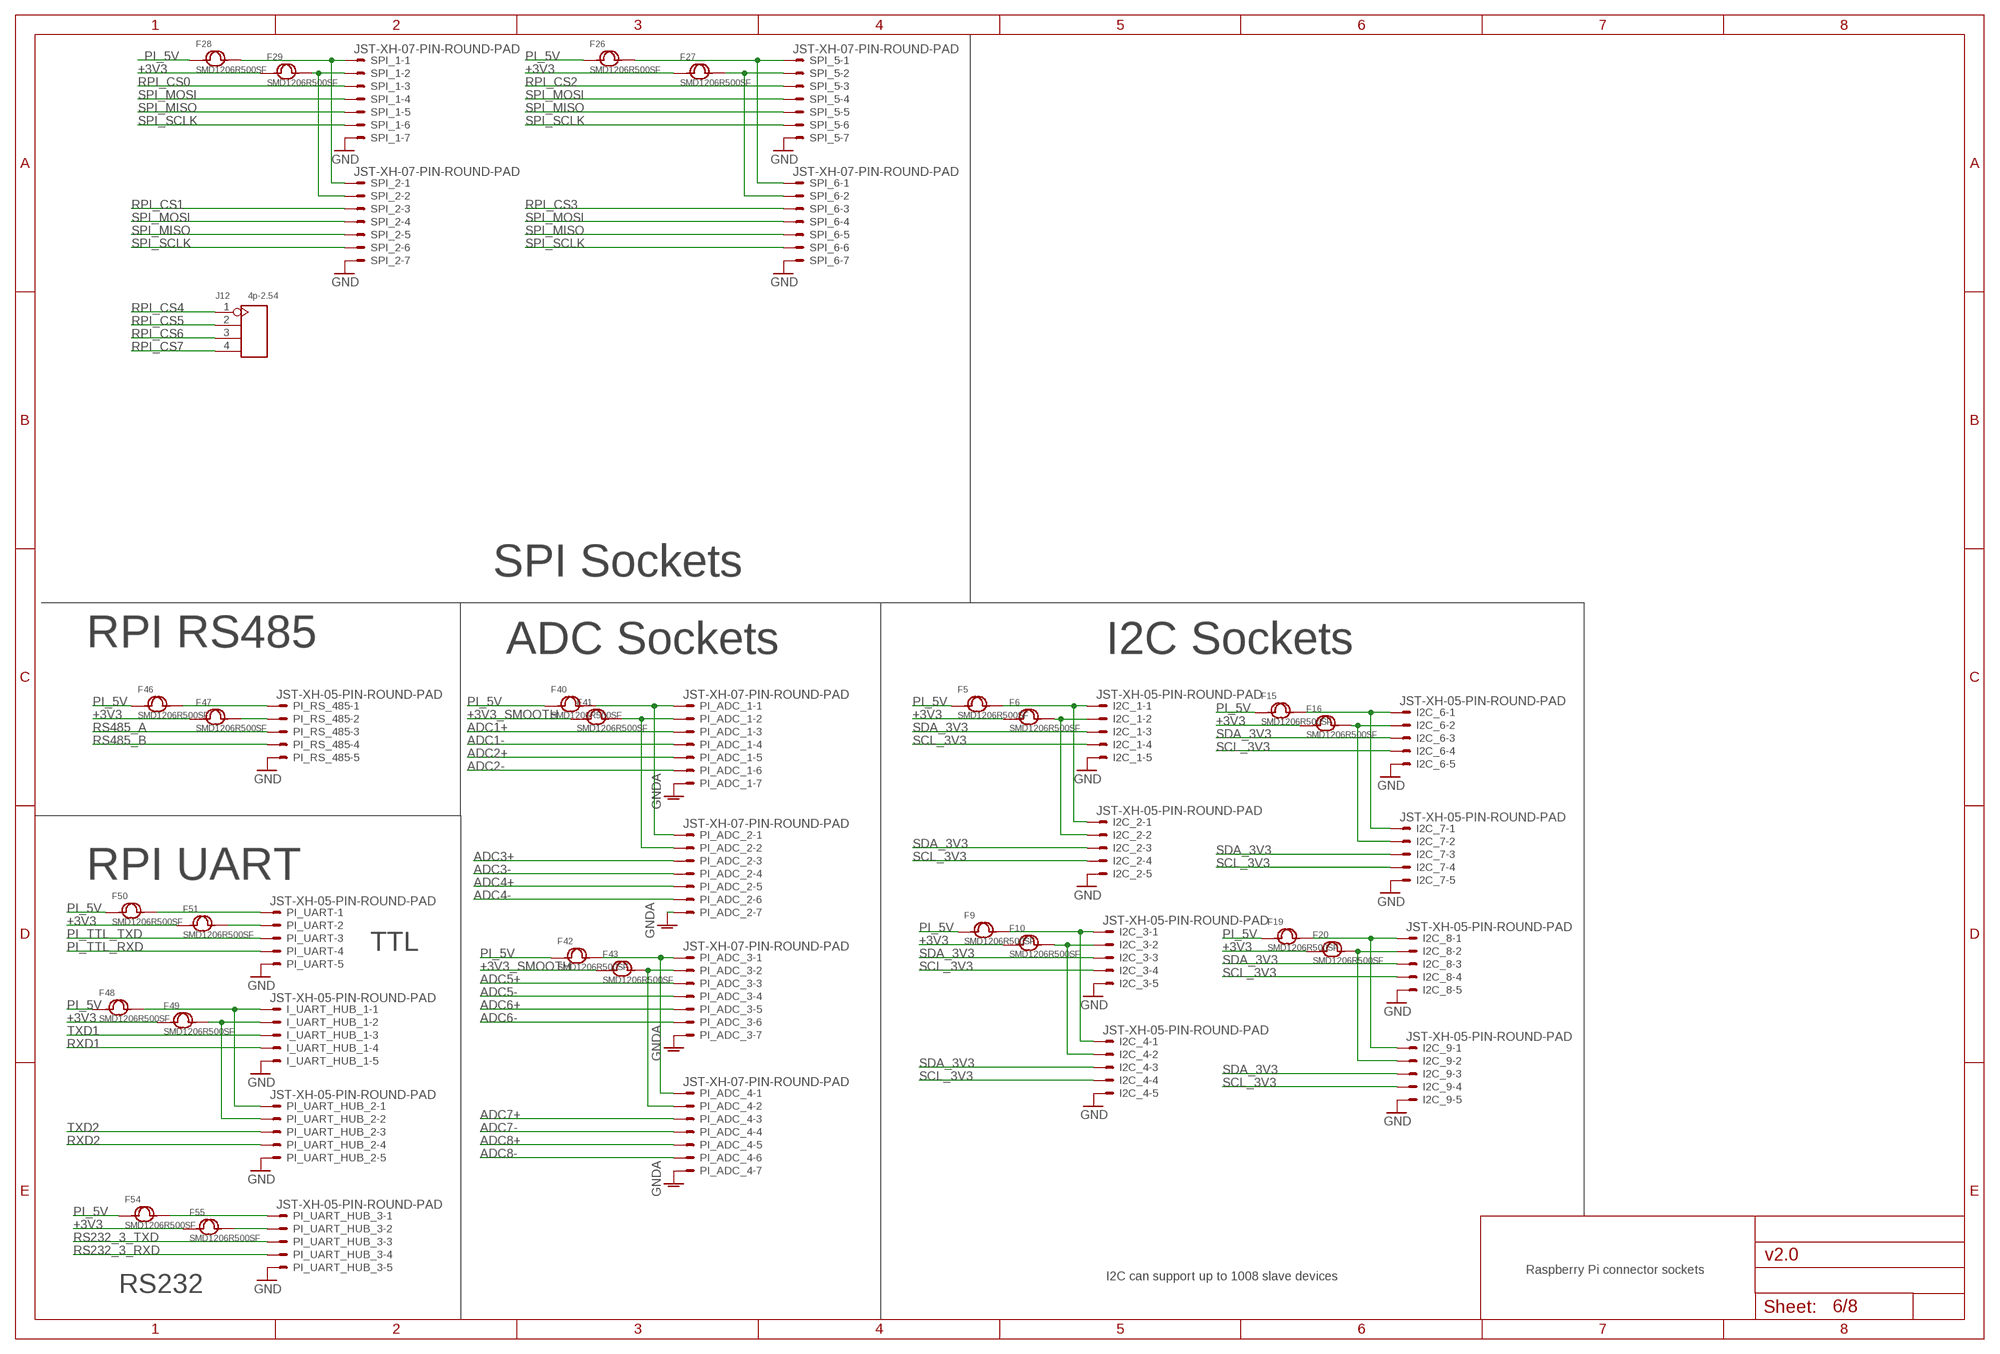
[diagram p5: schematic, sheet 6]

### Parts
F5  SMD1206R500SF  SMD-PPTC-500MA(1206)  [F1206]
F6  SMD1206R500SF  SMD-PPTC-500MA(1206)  [F1206]
F9  SMD1206R500SF  SMD-PPTC-500MA(1206)  [F1206]
F10  SMD1206R500SF  SMD-PPTC-500MA(1206)  [F1206]
F15  SMD1206R500SF  SMD-PPTC-500MA(1206)  [F1206]
F16  SMD1206R500SF  SMD-PPTC-500MA(1206)  [F1206]
F19  SMD1206R500SF  SMD-PPTC-500MA(1206)  [F1206]
F20  SMD1206R500SF  SMD-PPTC-500MA(1206)  [F1206]
F26  SMD1206R500SF  SMD-PPTC-500MA(1206)  [F1206]
F27  SMD1206R500SF  SMD-PPTC-500MA(1206)  [F1206]
F28  SMD1206R500SF  SMD-PPTC-500MA(1206)  [F1206]
F29  SMD1206R500SF  SMD-PPTC-500MA(1206)  [F1206]
F40  SMD1206R500SF  SMD-PPTC-500MA(1206)  [F1206]
F41  SMD1206R500SF  SMD-PPTC-500MA(1206)  [F1206]
F42  SMD1206R500SF  SMD-PPTC-500MA(1206)  [F1206]
F43  SMD1206R500SF  SMD-PPTC-500MA(1206)  [F1206]
F46  SMD1206R500SF  SMD-PPTC-500MA(1206)  [F1206]
F47  SMD1206R500SF  SMD-PPTC-500MA(1206)  [F1206]
F48  SMD1206R500SF  SMD-PPTC-500MA(1206)  [F1206]
F49  SMD1206R500SF  SMD-PPTC-500MA(1206)  [F1206]
F50  SMD1206R500SF  SMD-PPTC-500MA(1206)  [F1206]
F51  SMD1206R500SF  SMD-PPTC-500MA(1206)  [F1206]
F54  SMD1206R500SF  SMD-PPTC-500MA(1206)  [F1206]
F55  SMD1206R500SF  SMD-PPTC-500MA(1206)  [F1206]
I2C_1  JST-XH-05-PIN-ROUND-PAD  [JST-XH-05-PACKAGE-ROUND-PAD]
I2C_2  JST-XH-05-PIN-ROUND-PAD  [JST-XH-05-PACKAGE-ROUND-PAD]
I2C_3  JST-XH-05-PIN-ROUND-PAD  [JST-XH-05-PACKAGE-ROUND-PAD]
I2C_4  JST-XH-05-PIN-ROUND-PAD  [JST-XH-05-PACKAGE-ROUND-PAD]
I2C_6  JST-XH-05-PIN-ROUND-PAD  [JST-XH-05-PACKAGE-ROUND-PAD]
I2C_7  JST-XH-05-PIN-ROUND-PAD  [JST-XH-05-PACKAGE-ROUND-PAD]
I2C_8  JST-XH-05-PIN-ROUND-PAD  [JST-XH-05-PACKAGE-ROUND-PAD]
I2C_9  JST-XH-05-PIN-ROUND-PAD  [JST-XH-05-PACKAGE-ROUND-PAD]
I_UART_HUB_1  JST-XH-05-PIN-ROUND-PAD  [JST-XH-05-PACKAGE-ROUND-PAD]
J12  4p-2.54  DIP-BLACK-FEMALE-HEADER-VERT(4P-2.54)  [H4-2.54]
PI_ADC_1  JST-XH-07-PIN-ROUND-PAD  [JST-XH-07-PACKAGE-ROUND-PAD]
PI_ADC_2  JST-XH-07-PIN-ROUND-PAD  [JST-XH-07-PACKAGE-ROUND-PAD]
PI_ADC_3  JST-XH-07-PIN-ROUND-PAD  [JST-XH-07-PACKAGE-ROUND-PAD]
PI_ADC_4  JST-XH-07-PIN-ROUND-PAD  [JST-XH-07-PACKAGE-ROUND-PAD]
PI_RS_485  JST-XH-05-PIN-ROUND-PAD  [JST-XH-05-PACKAGE-ROUND-PAD]
PI_UART  JST-XH-05-PIN-ROUND-PAD  [JST-XH-05-PACKAGE-ROUND-PAD]
PI_UART_HUB_2  JST-XH-05-PIN-ROUND-PAD  [JST-XH-05-PACKAGE-ROUND-PAD]
PI_UART_HUB_3  JST-XH-05-PIN-ROUND-PAD  [JST-XH-05-PACKAGE-ROUND-PAD]
SPI_1  JST-XH-07-PIN-ROUND-PAD  [JST-XH-07-PACKAGE-ROUND-PAD]
SPI_2  JST-XH-07-PIN-ROUND-PAD  [JST-XH-07-PACKAGE-ROUND-PAD]
SPI_5  JST-XH-07-PIN-ROUND-PAD  [JST-XH-07-PACKAGE-ROUND-PAD]
SPI_6  JST-XH-07-PIN-ROUND-PAD  [JST-XH-07-PACKAGE-ROUND-PAD]

### Nets
+3V3: F6.1 F10.1 F16.1 F20.1 F27.1 F29.1 F47.1 F49.1 F51.1 F55.1 ; also sheet 1,3,5
+3V3_SMOOTH: F41.1 F43.1 ; also sheet 3,4,5
ADC1+: PI_ADC_1.3 ; also sheet 4
ADC1-: PI_ADC_1.4 ; also sheet 4
ADC2+: PI_ADC_1.5 ; also sheet 4
ADC2-: PI_ADC_1.6 ; also sheet 4
ADC3+: PI_ADC_2.3 ; also sheet 4
ADC3-: PI_ADC_2.4 ; also sheet 4
ADC4+: PI_ADC_2.5 ; also sheet 4
ADC4-: PI_ADC_2.6 ; also sheet 4
ADC5+: PI_ADC_3.3 ; also sheet 4
ADC5-: PI_ADC_3.4 ; also sheet 4
ADC6+: PI_ADC_3.5 ; also sheet 4
ADC6-: PI_ADC_3.6 ; also sheet 4
ADC7+: PI_ADC_4.3 ; also sheet 4
ADC7-: PI_ADC_4.4 ; also sheet 4
ADC8+: PI_ADC_4.5 ; also sheet 4
ADC8-: PI_ADC_4.6 ; also sheet 4
ADC_1_3V3_P: F41.2 PI_ADC_1.2 PI_ADC_2.2
ADC_1_5V_P: F40.2 PI_ADC_1.1 PI_ADC_2.1
ADC_3_5V_P: F42.2 PI_ADC_3.1 PI_ADC_4.1
ADC_4_3V3_P: F43.2 PI_ADC_3.2 PI_ADC_4.2
GND: I2C_1.5 I2C_2.5 I2C_3.5 I2C_4.5 I2C_6.5 I2C_7.5 I2C_8.5 I2C_9.5 I_UART_HUB_1.5 PI_RS_485.5 PI_UART.5 PI_UART_HUB_2.5 PI_UART_HUB_3.5 SPI_1.7 SPI_2.7 SPI_5.7 SPI_6.7 ; also sheet 1,2,3,5,7,8
GNDA: PI_ADC_1.7 PI_ADC_2.7 PI_ADC_3.7 PI_ADC_4.7 ; also sheet 3,4
PI_5V: F5.1 F9.1 F15.1 F19.1 F26.1 F28.1 F40.1 F42.1 F46.1 F48.1 F50.1 F54.1 ; also sheet 1,3,5
PI_5V_SPI_1_P: F28.2 SPI_1.1 SPI_2.1
PI_I2C_3V3_2: F10.2 I2C_3.2 I2C_4.2
PI_I2C_3V3_3: F6.2 I2C_1.2 I2C_2.2
PI_I2C_3V3_6: F16.2 I2C_6.2 I2C_7.2
PI_I2C_3V3_8: F20.2 I2C_8.2 I2C_9.2
PI_I2C_5V_P: F5.2 I2C_1.1 I2C_2.1
PI_I2C_5V_P2: F9.2 I2C_3.1 I2C_4.1
PI_I2C_5V_P5: F15.2 I2C_6.1 I2C_7.1
PI_I2C_5V_P7: F19.2 I2C_8.1 I2C_9.1
PI_RS485_3V3_P: F47.2 PI_RS_485.2
PI_RS485_5V_P: F46.2 PI_RS_485.1
PI_SPI_3V3_1_P: F29.2 SPI_1.2 SPI_2.2
PI_TTL_RXD: PI_UART.4 ; also sheet 1,2
PI_TTL_TXD: PI_UART.3 ; also sheet 1,2
PI_UART_3V3_P: F51.2 PI_UART.2
PI_UART_5V_P: F50.2 PI_UART.1
PI_UART_HUB_1_3V3_P: F49.2 I_UART_HUB_1.2 PI_UART_HUB_2.2
PI_UART_HUB_1_5V_P: F48.2 I_UART_HUB_1.1 PI_UART_HUB_2.1
RPI_CS0: SPI_1.3 ; also sheet 1
RPI_CS1: SPI_2.3 ; also sheet 1
RPI_CS2: SPI_5.3 ; also sheet 1
RPI_CS3: SPI_6.3 ; also sheet 1
RPI_CS4: J12.1 ; also sheet 1
RPI_CS5: J12.2 ; also sheet 1
RPI_CS6: J12.3 ; also sheet 1
RPI_CS7: J12.4 ; also sheet 1
RS232_3_RXD: PI_UART_HUB_3.4 ; also sheet 8
RS232_3_TXD: PI_UART_HUB_3.3 ; also sheet 8
RS485_A: PI_RS_485.3 ; also sheet 7
RS485_B: PI_RS_485.4 ; also sheet 7
RXD1: I_UART_HUB_1.4 ; also sheet 8
RXD2: PI_UART_HUB_2.4 ; also sheet 8
SCL_3V3: I2C_1.4 I2C_2.4 I2C_3.4 I2C_4.4 I2C_6.4 I2C_7.4 I2C_8.4 I2C_9.4 ; also sheet 1,4
SDA_3V3: I2C_1.3 I2C_2.3 I2C_3.3 I2C_4.3 I2C_6.3 I2C_7.3 I2C_8.3 I2C_9.3 ; also sheet 1,4
SPI_3V3_5_P: F27.2 SPI_5.2 SPI_6.2
SPI_5V_5_P: F26.2 SPI_5.1 SPI_6.1
SPI_MISO: SPI_1.5 SPI_2.5 SPI_5.5 SPI_6.5 ; also sheet 1
SPI_MOSI: SPI_1.4 SPI_2.4 SPI_5.4 SPI_6.4 ; also sheet 1
SPI_SCLK: SPI_1.6 SPI_2.6 SPI_5.6 SPI_6.6 ; also sheet 1
TXD1: I_UART_HUB_1.3 ; also sheet 8
TXD2: PI_UART_HUB_2.3 ; also sheet 8
UART_HUB_3_3V3_P: F55.2 PI_UART_HUB_3.2
UART_USB_HUB_3_5V: F54.2 PI_UART_HUB_3.1

### Notes on the sheet
- SPI Sockets
- RPI RS485 | ADC Sockets | I2C Sockets
- RPI UART
- TTL
- Raspberry Pi connector sockets
- I2C can support up to 1008 slave devices
- RS232

## Sheet 7 of 8
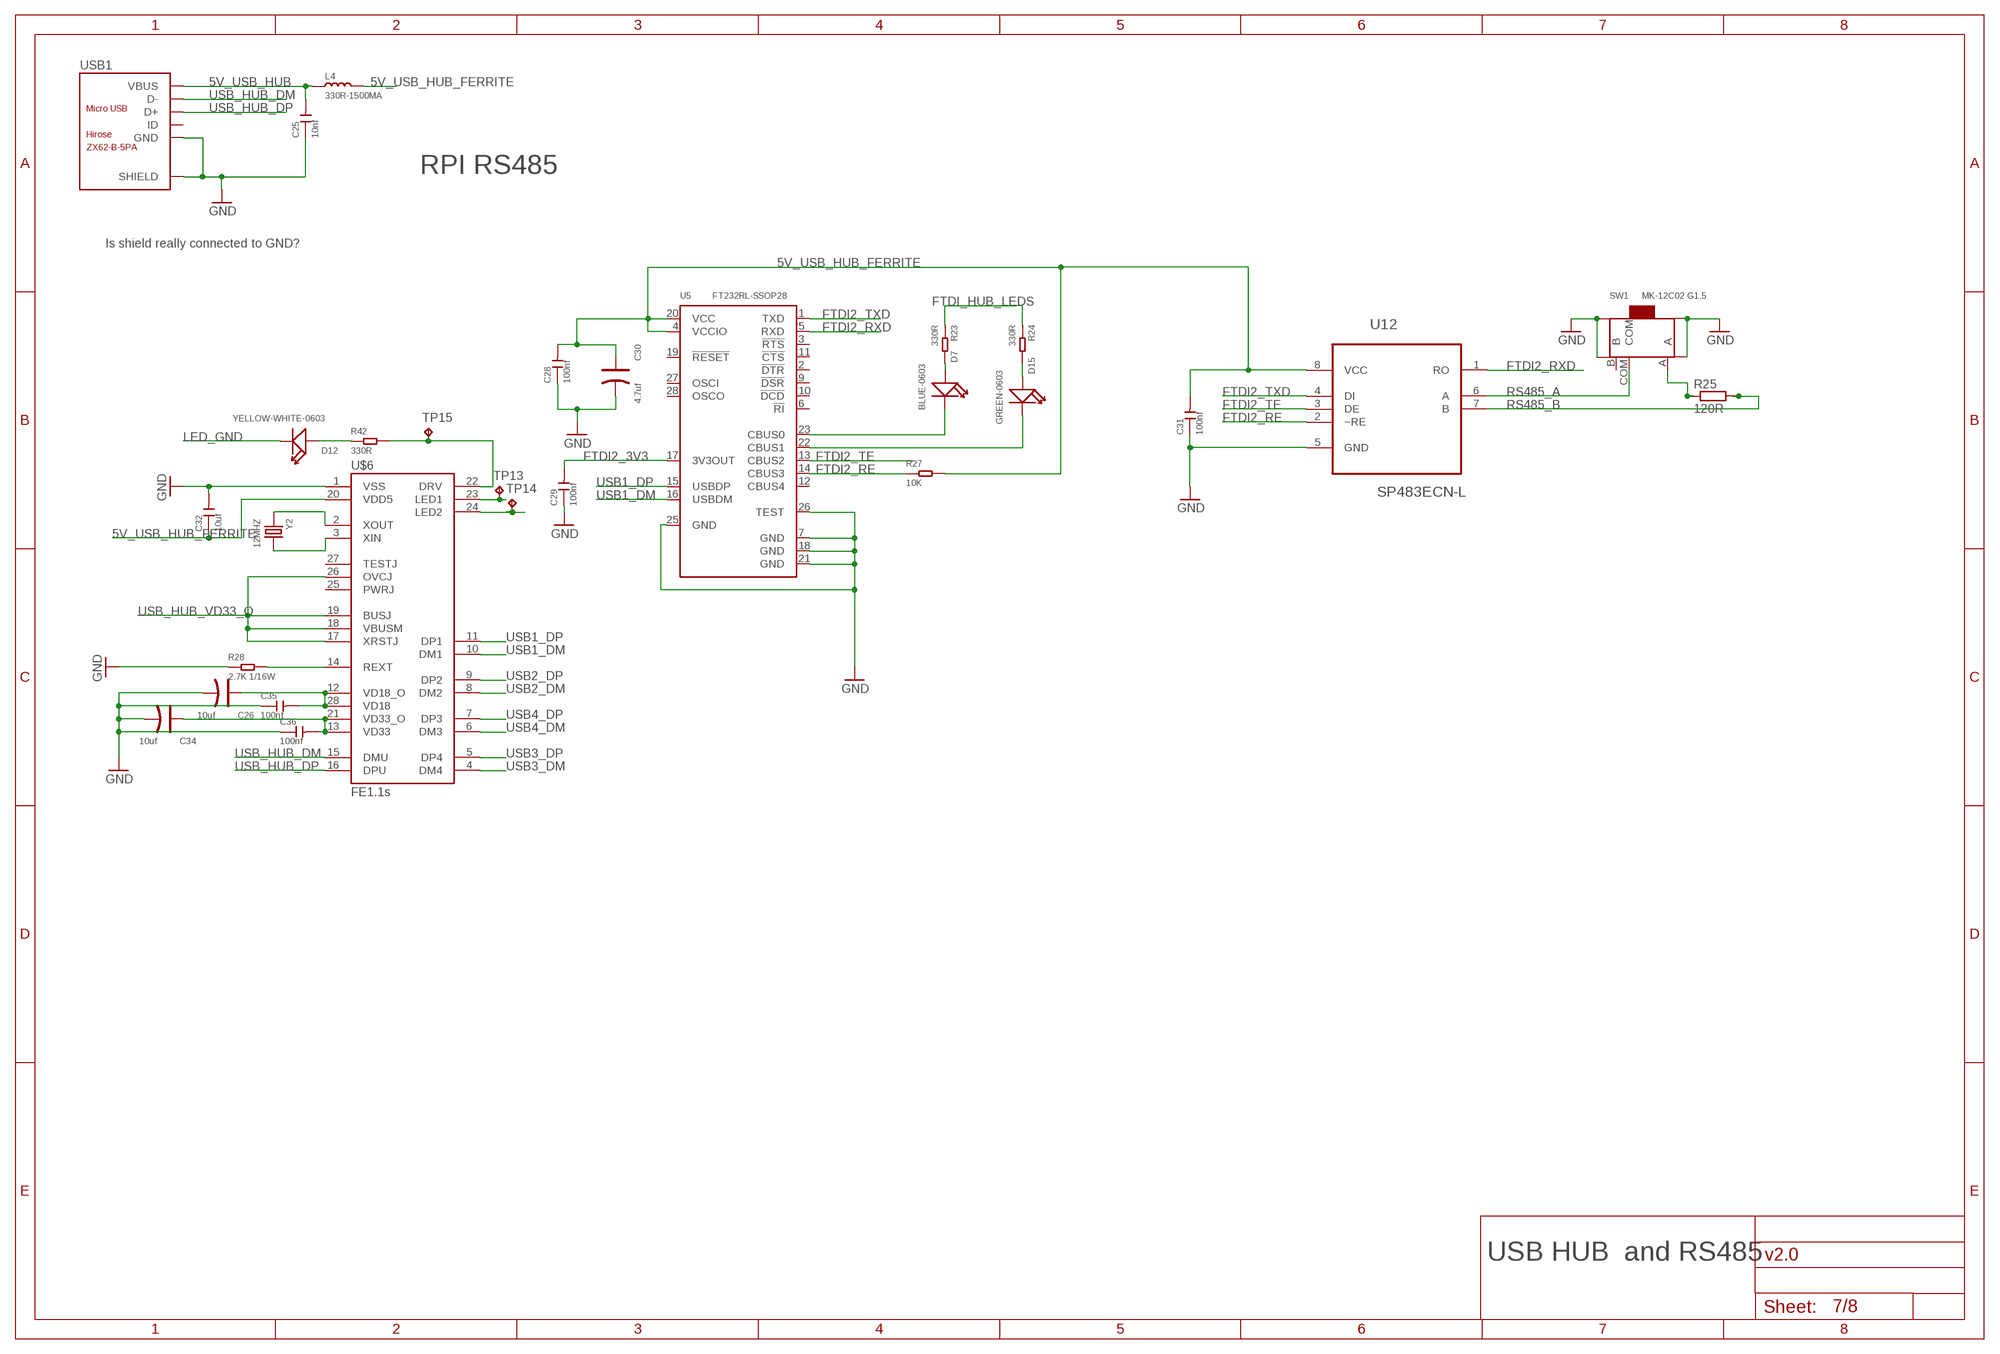
[diagram p6: schematic, sheet 7]

### Parts
C25  10nf  CERAMIC-10NF-50V-10%-X7R(0603)  [C0603]
C26  10uf  TANTALUM-SMD-10UF-16V-10%(AVX-A)  [AVX-A]
C28  100nf  CERAMIC-100NF-50V-10%-X7R(0603)  [C0603]
C29  100nf  CERAMIC-100NF-50V-10%-X7R(0603)  [C0603]
C30  4.7uf  TANTALUM-SMD-4.7UF-16V(AVX-A)  [AVX-A]
C31  100nf  CERAMIC-100NF-50V-10%-X7R(0603)  [C0603]
C32  10uf  CERAMIC-10UF-25V-10%-X5R(0805)  [C0805]
C34  10uf  TANTALUM-SMD-10UF-16V-10%(AVX-A)  [AVX-A]
C35  100nf  CERAMIC-100NF-50V-10%-X7R(0603)  [C0603]
C36  100nf  CERAMIC-100NF-50V-10%-X7R(0603)  [C0603]
D7  BLUE-0603  SMD-LED-CLEAR-BLUE(0603)  [LED-0603]
D12  YELLOW-WHITE-0603  SMD-LED-YELLOW-WHITE(0603)  [LED-0603]
D15  GREEN-0603  SMD-LED-CLEAR-GREEN(0603)  [LED-0603]
L4  330R-1500MA  SMD-FERRITE-BEAD-330R-1500MA(0805)'0805'  [L0805]
R23  330R  SMD-RES-330R-1%-1/10W(0603)  [R0603]
R24  330R  SMD-RES-330R-1%-1/10W(0603)  [R0603]
R25  120R  R-EU_R0603  [R0603]
R27  10K  SMD-RES-10K-1%-1/10W(0603)  [R0603]
R28  2.7K 1/16W  SMD-RES-2.7K-1%-1/16W(0402)  [R0402]
R42  330R  SMD-RES-330R-1%-1/10W(0603)  [R0603]
SW1  MK-12C02 G1.5  SMD-TOGGLE-SWITCH-ON-ON(3+4P-6.7X2.7MM)  [SW7-SMD-L6.7X2.7X3.2MM]
TP13  TPB2,54  [B2,54]
TP14  TPB2,54  [B2,54]
TP15  TPB2,54  [B2,54]
U5  FT232RL-SSOP28  INTERFACE-FT232RL(SSOP28)  [SSOP28-0.65-10.2X5.2MM]
U12  SP483ECN-L  [SOIC127P600X175-8N]
U$6  FE1.1S  [FE1.1S_SSOP-28]
USB1  ZX62-B-5PA  MICRO-USB-SMD(ZX62-B-5PA)  [MICRO-USB5+6P-SMD-0.65-AB]
Y2  12MHZ  SMD-CRYSTAL-12MHZ-20PF-20PPM-40R(2P-5.0X3.2MM)  [X2-SMD-5.0X3.2X1.3MM]

### Nets
5V_USB_HUB: C25.2 L4.1 USB1.1(VBUS) ; also sheet 5
5V_USB_HUB_FERRITE: C28.2 C30.+ C31.2 C32.1 L4.2 R27.2 U5.4(VCCIO) U5.20(VCC) U12.8(VCC) U$6.20(VDD5) ; also sheet 8
FTDI2_3V3: C29.2 U5.17(3V3OUT)
FTDI2_RE: R27.1 U5.14(CBUS3) U12.2(~RE)
FTDI2_RXD: U5.5(RXD) U12.1(RO)
FTDI2_TE: U5.13(CBUS2) U12.3(DE)
FTDI2_TXD: U5.1(TXD) U12.4(DI)
FTDI_HUB_LEDS: R23.1 R24.1 ; also sheet 8
GND: C25.1 C26.- C28.1 C29.1 C30.- C31.1 C32.2 C34.- C35.1 C36.1 R28.1 SW1.SS1 SW1.SS2 SW1.SS3 SW1.SS4 U5.7(GND) U5.18(GND) U5.21(GND) U5.25(GND) U5.26(TEST) U12.5(GND) U$6.1(VSS) USB1.5(GND) USB1.P1(SHIELD) USB1.P2(SHIELD) USB1.P3(SHIELD) USB1.P4(SHIELD) USB1.P5(SHIELD) USB1.P6(SHIELD) ; also sheet 1,2,3,5,6,8
LED_GND: D12.- ; also sheet 5
N$9: R25.1 SW1.A
N$31: D15.+ R24.2
N$42: D7.+ R23.2
N$49: D12.+ R42.1
N$102: U$6.2(XOUT) Y2.1
N$103: U$6.3(XIN) Y2.2
N$104: R28.2 U$6.14(REXT)
N$105: C26.+ C35.2 U$6.12(VD18_O) U$6.28(VD18)
N$106: C34.+ C36.2 U$6.13(VD33) U$6.21(VD33_O)
RS485_A: SW1.COM U12.6(A) ; also sheet 6
RS485_B: R25.2 U12.7(B) ; also sheet 6
RS485_CBUS0: D7.- U5.23(CBUS0)
RS485_CBUS2: D15.- U5.22(CBUS1)
USB1_DM: U5.16(USBDM) U$6.10(DM1)
USB1_DP: U5.15(USBDP) U$6.11(DP1)
USB2_DM: U$6.8(DM2) ; also sheet 8
USB2_DP: U$6.9(DP2) ; also sheet 8
USB3_DM: U$6.4(DM4) ; also sheet 8
USB3_DP: U$6.5(DP4) ; also sheet 8
USB4_DM: U$6.6(DM3) ; also sheet 8
USB4_DP: U$6.7(DP3) ; also sheet 8
USB_HUB_DM: U$6.15(DMU) USB1.2(D-)
USB_HUB_DP: U$6.16(DPU) USB1.3(D+)
USB_HUB_DRV: R42.2 TP15.TP U$6.22(DRV)
USB_HUB_LED1: TP13.TP U$6.23(LED1)
USB_HUB_LED2: TP14.TP U$6.24(LED2)
USB_HUB_VD33_O: U$6.17(XRSTJ) U$6.18(VBUSM) U$6.19(BUSJ) U$6.26(OVCJ)
Unconnected: SW1.B U5.2(!DTR) U5.3(!RTS) U5.6(!RI) U5.9(!DSR) U5.10(!DCD) U5.11(!CTS) U5.12(CBUS4) U5.19(!RESET) U5.27(OSCI) U5.28(OSCO) U$6.25(PWRJ) U$6.27(TESTJ) USB1.4(ID)

### Notes on the sheet
- RPI RS485
- Is shield really connected to GND?
- USB HUB  and RS485

## Sheet 8 of 8
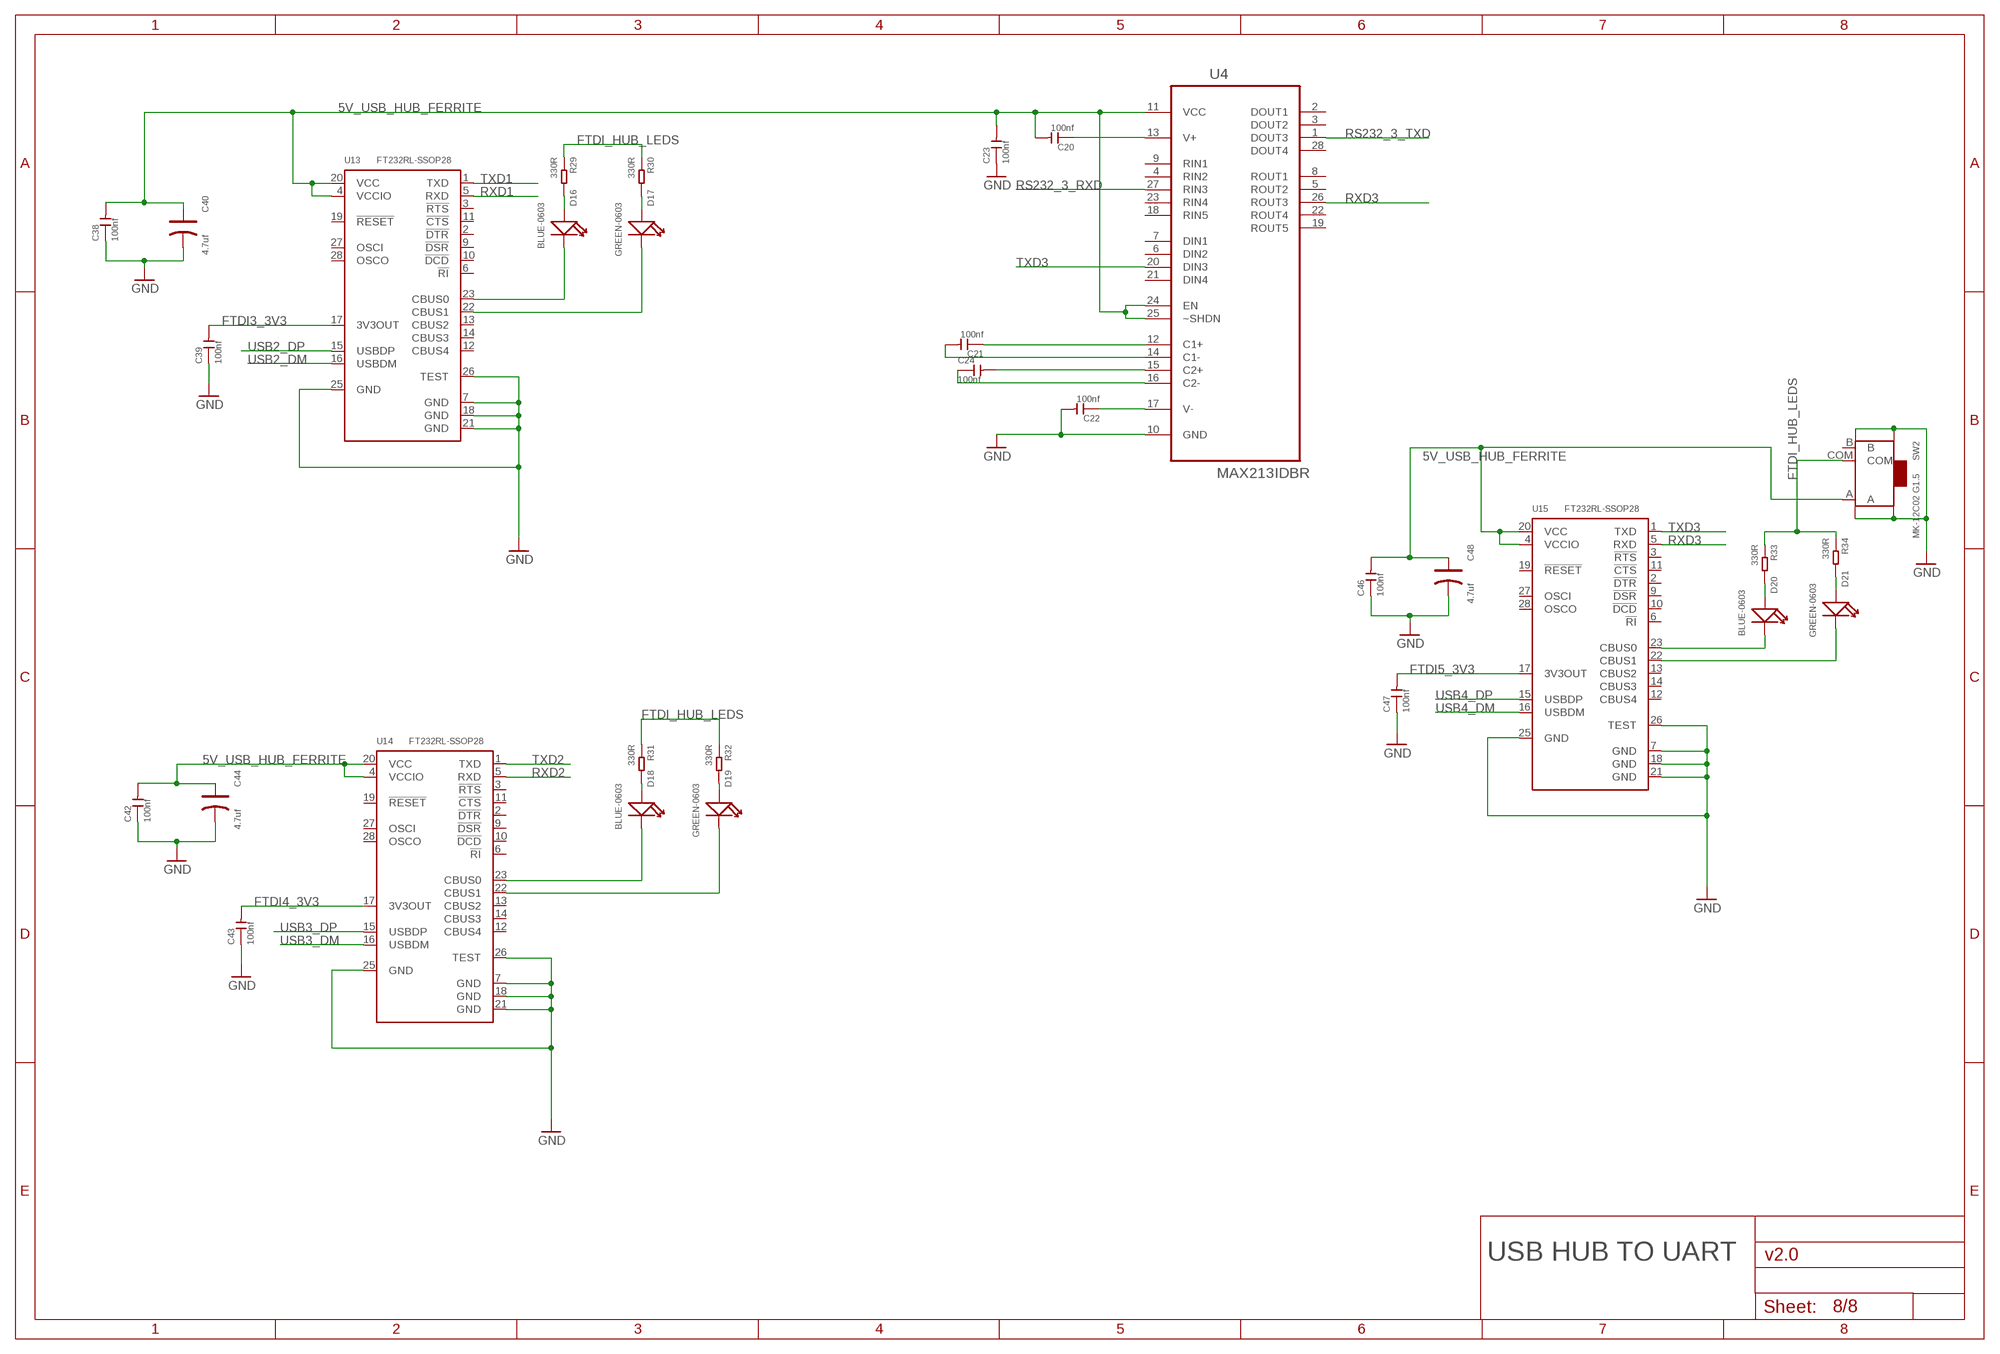
[diagram p7: schematic, sheet 8]

### Parts
C20  100nf  CERAMIC-100NF-50V-10%-X7R(0603)  [C0603]
C21  100nf  CERAMIC-100NF-50V-10%-X7R(0603)  [C0603]
C22  100nf  CERAMIC-100NF-50V-10%-X7R(0603)  [C0603]
C23  100nf  CERAMIC-100NF-50V-10%-X7R(0603)  [C0603]
C24  100nf  CERAMIC-100NF-50V-10%-X7R(0603)  [C0603]
C38  100nf  CERAMIC-100NF-50V-10%-X7R(0603)  [C0603]
C39  100nf  CERAMIC-100NF-50V-10%-X7R(0603)  [C0603]
C40  4.7uf  TANTALUM-SMD-4.7UF-16V(AVX-A)  [AVX-A]
C42  100nf  CERAMIC-100NF-50V-10%-X7R(0603)  [C0603]
C43  100nf  CERAMIC-100NF-50V-10%-X7R(0603)  [C0603]
C44  4.7uf  TANTALUM-SMD-4.7UF-16V(AVX-A)  [AVX-A]
C46  100nf  CERAMIC-100NF-50V-10%-X7R(0603)  [C0603]
C47  100nf  CERAMIC-100NF-50V-10%-X7R(0603)  [C0603]
C48  4.7uf  TANTALUM-SMD-4.7UF-16V(AVX-A)  [AVX-A]
D16  BLUE-0603  SMD-LED-CLEAR-BLUE(0603)  [LED-0603]
D17  GREEN-0603  SMD-LED-CLEAR-GREEN(0603)  [LED-0603]
D18  BLUE-0603  SMD-LED-CLEAR-BLUE(0603)  [LED-0603]
D19  GREEN-0603  SMD-LED-CLEAR-GREEN(0603)  [LED-0603]
D20  BLUE-0603  SMD-LED-CLEAR-BLUE(0603)  [LED-0603]
D21  GREEN-0603  SMD-LED-CLEAR-GREEN(0603)  [LED-0603]
R29  330R  SMD-RES-330R-1%-1/10W(0603)  [R0603]
R30  330R  SMD-RES-330R-1%-1/10W(0603)  [R0603]
R31  330R  SMD-RES-330R-1%-1/10W(0603)  [R0603]
R32  330R  SMD-RES-330R-1%-1/10W(0603)  [R0603]
R33  330R  SMD-RES-330R-1%-1/10W(0603)  [R0603]
R34  330R  SMD-RES-330R-1%-1/10W(0603)  [R0603]
SW2  MK-12C02 G1.5  SMD-TOGGLE-SWITCH-ON-ON(3+4P-6.7X2.7MM)  [SW7-SMD-L6.7X2.7X3.2MM]
U4  MAX213IDBR  [SOP65P780X200-28N]
U13  FT232RL-SSOP28  INTERFACE-FT232RL(SSOP28)  [SSOP28-0.65-10.2X5.2MM]
U14  FT232RL-SSOP28  INTERFACE-FT232RL(SSOP28)  [SSOP28-0.65-10.2X5.2MM]
U15  FT232RL-SSOP28  INTERFACE-FT232RL(SSOP28)  [SSOP28-0.65-10.2X5.2MM]

### Nets
5V_USB_HUB_FERRITE: C20.2 C23.2 C38.2 C40.+ C42.2 C44.+ C46.2 C48.+ SW2.A U4.11(VCC) U4.24(EN) U4.25(~SHDN) U13.4(VCCIO) U13.20(VCC) U14.4(VCCIO) U14.20(VCC) U15.4(VCCIO) U15.20(VCC) ; also sheet 7
FTDI3_3V3: C39.2 U13.17(3V3OUT)
FTDI4_3V3: C43.2 U14.17(3V3OUT)
FTDI5_3V3: C47.2 U15.17(3V3OUT)
FTDI_HUB_LEDS: R29.1 R30.1 R31.1 R32.1 R33.1 R34.1 SW2.COM ; also sheet 7
GND: C22.2 C23.1 C38.1 C39.1 C40.- C42.1 C43.1 C44.- C46.1 C47.1 C48.- SW2.SS1 SW2.SS2 SW2.SS3 SW2.SS4 U4.10(GND) U13.7(GND) U13.18(GND) U13.21(GND) U13.25(GND) U13.26(TEST) U14.7(GND) U14.18(GND) U14.21(GND) U14.25(GND) U14.26(TEST) U15.7(GND) U15.18(GND) U15.21(GND) U15.25(GND) U15.26(TEST) ; also sheet 1,2,3,5,6,7
N$11: C20.1 U4.13(V+)
N$17: C22.1 U4.17(V-)
N$23: C21.1 U4.12(C1+)
N$25: C21.2 U4.14(C1-)
N$28: D20.+ R33.2
N$38: C24.2 U4.15(C2+)
N$41: C24.1 U4.16(C2-)
N$51: D21.+ R34.2
N$52: D16.+ R29.2
N$53: D17.+ R30.2
N$55: D18.+ R31.2
N$56: D19.+ R32.2
RS232_1_LED1: D16.- U13.23(CBUS0)
RS232_1_LED2: D17.- U13.22(CBUS1)
RS232_2_LED1: D18.- U14.23(CBUS0)
RS232_2_LED2: D19.- U14.22(CBUS1)
RS232_3_LED1: D20.- U15.23(CBUS0)
RS232_3_LED2: D21.- U15.22(CBUS1)
RS232_3_RXD: U4.27(RIN3) ; also sheet 6
RS232_3_TXD: U4.1(DOUT3) ; also sheet 6
RXD1: U13.5(RXD) ; also sheet 6
RXD2: U14.5(RXD) ; also sheet 6
RXD3: U4.26(ROUT3) U15.5(RXD)
TXD1: U13.1(TXD) ; also sheet 6
TXD2: U14.1(TXD) ; also sheet 6
TXD3: U4.20(DIN3) U15.1(TXD)
USB2_DM: U13.16(USBDM) ; also sheet 7
USB2_DP: U13.15(USBDP) ; also sheet 7
USB3_DM: U14.16(USBDM) ; also sheet 7
USB3_DP: U14.15(USBDP) ; also sheet 7
USB4_DM: U15.16(USBDM) ; also sheet 7
USB4_DP: U15.15(USBDP) ; also sheet 7
Unconnected: SW2.B U4.2(DOUT1) U4.3(DOUT2) U4.4(RIN2) U4.5(ROUT2) U4.6(DIN2) U4.7(DIN1) U4.8(ROUT1) U4.9(RIN1) U4.18(RIN5) U4.19(ROUT5) U4.21(DIN4) U4.22(ROUT4) U4.23(RIN4) U4.28(DOUT4) U13.2(!DTR) U13.3(!RTS) U13.6(!RI) U13.9(!DSR) U13.10(!DCD) U13.11(!CTS) U13.12(CBUS4) U13.13(CBUS2) U13.14(CBUS3) U13.19(!RESET) U13.27(OSCI) U13.28(OSCO) U14.2(!DTR) U14.3(!RTS) U14.6(!RI) U14.9(!DSR) U14.10(!DCD) U14.11(!CTS) U14.12(CBUS4) U14.13(CBUS2) U14.14(CBUS3) U14.19(!RESET) U14.27(OSCI) U14.28(OSCO) U15.2(!DTR) U15.3(!RTS) U15.6(!RI) U15.9(!DSR) U15.10(!DCD) U15.11(!CTS) U15.12(CBUS4) U15.13(CBUS2) U15.14(CBUS3) U15.19(!RESET) U15.27(OSCI) U15.28(OSCO)

### Notes on the sheet
- USB HUB TO UART

## Library data of the parts
BAT1 = Seeed-Connector -2016:DIP-BATTERY-CELL-HOLDER(1220): 320170002
C2 C6 C7 C11-C14 C19 C28 C29 C35 C36 C38 C39 C42 C43 C46 C47 = Seeed-Capacitor-2016:CERAMIC-100NF-50V-10%-X7R(0603): 302010138; MPN: CC0603KRX7R9BB104
C4 C5 C8 C10 = Seeed-Capacitor:TANTALUM-SMD-10UF-10V-10%(AVX-A): 302020011; MPN: TAJA106K010RNJ
C18 C20-C24 C31 = Seeed-Capacitor:CERAMIC-100NF-50V-10%-X7R(0603): 302010138; MPN: CC0603KRX7R9BB104
C25 = Seeed-Capacitor-2016:CERAMIC-10NF-50V-10%-X7R(0603): 302010140; MPN: CC0603KRX7R9BB103
C26 C34 = Seeed-Capacitor:TANTALUM-SMD-10UF-16V-10%(AVX-A): 302020002; MPN: TAJA106K016RNJ
C30 = Seeed-Capacitor-2016:TANTALUM-SMD-4.7UF-16V(AVX-A): 302020006; MPN: TAJA475*016#NJ
C32 = Seeed-Capacitor-2016:CERAMIC-10UF-25V-10%-X5R(0805): 302010178; MPN: CC0805KKX5R8BB106
C40 C44 C48 = Seeed-Capacitor:TANTALUM-SMD-4.7UF-16V(AVX-A): 302020006; MPN: TAJA475*016#NJ
D1 = Seeed-Diode-2016:SMD-DIODE-SCHOTTKY-28V-5A(DO-214AA): 304020021; MPN: SS54B
D4-D6 D8 D9 D13 D14 D22 = Seeed-LED-2016:LED-SMD-RED-DIFFUSED(0603): 304090042; MPN: 19-217-R6C-AL1M2VY-3T
D7 D16 D18 D20 = Seeed-LED:SMD-LED-CLEAR-BLUE(0603): 304090045; MPN: 19-217-BHC-ZL1M2RY-3T
D11 = Seeed-LED-2016:SMD-LED-CLEAR-BLUE(0603): 304090045; MPN: 19-217-BHC-ZL1M2RY-3T
D12 = Seeed-LED-2016:SMD-LED-YELLOW-WHITE(0603): 304090071; MPN: ADL-0603W
D15 D17 D19 D21 = Seeed-LED:SMD-LED-CLEAR-GREEN(0603): 304090043; MPN: 19-217-G7C-AN1P2-3T
F1 = imported-parts:FUSE-2920
F2 F5 F6 F9 F10 F15 F16 F19 F20 F26-F29 F40-F43 F46-F51 F54-F57 F59 F60 F62 F76 F78 F79 F82 F83 = Seeed-Fuse:SMD-PPTC-500MA(1206): 307010002; MPN: SMD1206R500SF
H1-H6 = holes:MOUNT-HOLE: MOUNTING HOLE with drill center marker
I2C_1-I2C_4 I2C_6-I2C_9 I_UART_HUB_1 LOPY_I2C LOPY_UART0 LOPY_UART1 PI_RS_485 PI_UART PI_UART_HUB_2 PI_UART_HUB_3 = Rembrandt Electronics - JST XH Connectors v1-0 2:JST-XH-05-PIN: JST XH Connector 2 Pin Wire to board connector. Pitch: 2,54 mm, (0.100") Number of pins: 5 Created by Rembrandt Electronics www.rembrandtelectronics.com
J1 = Seeed-Connector -2016:JACK-DC-044-A: 320120002; MPN: JACK-DC-044-A
J2 = Seeed-Connector:MICRO-SD-CARD-HOLDER-9P: 320090008
J3 J4 = Seeed-Connector:DIP-BLACK-MALE-HEADER-VERT(2P-2.54): 320020016; MPN: P125-1102A0BS116A1
J5-J7 J9-J11 = Seeed-Connector:DIP-BLACK-MALE-HEADER-VERT(16P-2.54): 320020034; MPN: P125-1116A0BS116AX
J12 = Seeed-Connector:DIP-BLACK-FEMALE-HEADER-VERT(4P-2.54): 320030017; MPN: F185-1104A1BSYA1
JP1 JP2 = jumper:JP1E: JUMPER
L2-L4 = Seeed-Inductor-2016:SMD-FERRITE-BEAD-330R-1500MA(0805): 303030006; MPN: BLM21PG331SN1D
LOPY_SPI PI_ADC_1-PI_ADC_4 SPI_1 SPI_2 SPI_5 SPI_6 = Rembrandt Electronics - JST XH Connectors v1-0 2:JST-XH-07-PIN: JST XH Connector 2 Pin Wire to board connector. Pitch: 2,54 mm, (0.100") Number of pins: 7 Created by Rembrandt Electronics www.rembrandtelectronics.com
PCB1 = e14_Rpi2_RevA:RPI2: Device for Raspberry Pi 2 board created by www.element14.com More information and support community is available at http://www.element14.com/community/community/raspberry-pi/raspberrypi2
Q2 Q5 = Seeed-Transistor:SMD-MOSFET-P-CH-20V-6A-SSM3J328R(SOT-23): 305030075; MPN: SSM3J328R,LF
Q3 Q4 Q6 Q7 = Seeed-Transistor:SMD-MOSFET-N-CH-50V-200MA-BSS138W-7-F(SOT-23): 305030000; MPN: BSS138W-7-F
Q8 = Seeed-Transistor:SMD-MOSFET-P-CH-8V-4.1A-CJ2305(SOT-23): 305030014; MPN: CJ2305
Q9 Q10 = Seeed-Transistor:SMD-TRANSISTORS-PNP-25V-500MA-S8550(SOT-23): 305020006; MPN: S8550
R2 R16 R18 R19 R26 R27 = Seeed-Resistor:SMD-RES-10K-1%-1/10W(0603): 301010299; MPN: RC0603FR-0710KL
R4 R6 R21 = Seeed-Resistor:SMD-RES-220R-5%-1/10W(0603): 301010163; MPN: RC0603JR-07220RL
R5 R35 = Seeed-Resistor-2016:SMD-RES-1K-1%-1/10W(0603): 301010298; MPN: RC0603FR-071KL
R7 R23 R24 R29-R34 = Seeed-Resistor:SMD-RES-330R-1%-1/10W(0603): 301010300; MPN: RC0603FR-07330RL
R8 R12 R15 R17 R41 = Seeed-Resistor:SMD-RES-0R-5%-1/10W(0603): 301010292; MPN: RC0603JR-070RL
R9 R10 R22 = Seeed-Resistor:SMD-RES-100R-5%-1/10W(0603): 301010090; MPN: RC0603JR-07100RL
R20 = Seeed-Resistor:SMD-RES-15K-1%-1/10W(0603): 301010241; MPN: RC0603FR-0715KL
R25 = rcl:R-EU_: RESISTOR, European symbol
R28 = Seeed-Resistor-2016:SMD-RES-2.7K-1%-1/16W(0402): 301010671; MPN: RC0402FR-072K7L
R36 = Seeed-Resistor:SMD-RES-1K-1%-1/10W(0603): 301010298; MPN: RC0603FR-071KL
R37 R38 = Seeed-Resistor-2016:SMD-RES-3.9K-5%-1/10W(0603): 301010101; MPN: RC0603JR-073K9L
R39 R40 R43-R46 = Seeed-Resistor:SMD-RES-100K-5%-1/10W(0603): 301010089; MPN: RC0603JR-07100KL
R42 = Seeed-Resistor-2016:SMD-RES-330R-1%-1/10W(0603): 301010300; MPN: RC0603FR-07330RL
R47 = Seeed-Resistor:SMD-RES-47K-5%-1/10W(0603): 301010084; MPN: RC0603JR-0747KL
SW1-SW4 = Seeed-Switch:SMD-TOGGLE-SWITCH-ON-ON(3+4P-6.7X2.7MM): 311030001; MPN: MK-12C02 G1.5
TP1-TP4 TP6-TP17 = testpad:TP: Test pad
U1 = imported-parts:MCP23017-E/SO: IC, 16-Bit I/O Expander with Serial Interface, SOIC-28; MPN: MCP23017-E/SO; OC_FARNELL: 1332087; OC_NEWARK: 34M7442; PACKAGE: SOIC-28; SUPPLIER: Microchip
U2 = imported-parts:DS3231SN: Extremely Accurate I2C-Integrated RTC/TCXO/Crystal; MPN: DS3231SN#; OC_FARNELL: 1593292; OC_NEWARK: 68K3406; PACKAGE: SOIC-16; SUPPLIER: Maxim
U3 = pycom:LOPY
U4 = ti-max213:MAX213IDBR: RS-232 LINE DRIVER/RECEIVER; MPN: MAX213IDBR; OC_FARNELL: 1575352; OC_NEWARK: 71K6673; PACKAGE: TSSOP-28; SUPPLIER: TEXAS INSTRUMENTS
U5 U13-U15 = Seeed-IC:INTERFACE-FT232RL(SSOP28): 310070022; MPN: FT232RL
U8 = farnell-parts:BR24G32-3: http://uk.farnell.com/rohm/br24g32fj-3gte2/serial-eeprom-32kbit-1mhz-sop/dp/2373743?MER=sy-me-pd-mi-alte
U10 = imported-parts:74HCT139D: Dual 2-to-4 line decoder; MPN: 74HCT139D; OC_FARNELL: 1085308; OC_NEWARK: 99K0549; PACKAGE: SOIC-16; SUPPLIER: NXP
U11 = Diodes_Inc_By_element14_Batch_1:BZX84C30: 350mW SURFACE MOUNT ZENER DIODE; MPN: BZX84C30; OC_FARNELL: 1902456; OC_NEWARK: -; PACKAGE: SOT-23-3; SUPPLIER: DIODES INC.
U12 = SP483:SP483ECN-L: Transceiver; MPN: SP483ECN-L; OC_FARNELL: 9387129; OC_NEWARK: 24R0561; PACKAGE: SOIC-8; SUPPLIER: Exar
U$1 U$2 = MCP3424:MCP3424-E/SL: Analog-to-Digital Converter; MPN: MCP3424-E/SL; OC_FARNELL: 1630424; OC_NEWARK: 54M4871; PACKAGE: SOIC-14; SUPPLIER: Microchip
U$3 = C106DG_thyristor:C106DG
U$4 = mic29300:MIC29300
U$5 = diy-modules:DC-DC-STEP-DOWN-LM2596: DC/DC Step-Down Regulator based on LM2596-ADJ chip LM2596 datasheet available here: http://www.ti.com/lit/ds/symlink/lm2596.pdf Click here to find device on ebay.com <http://www.ebay.com/sch/lm2596+power+regulator>
U$6 = FE1.1s:FE1.1S: A USB 2.0 hub IC. http://www.jfd-ic.com/Documents/FE1.1s%20Data%20Sheet%20%28Rev.%201.0%29.pdf
U$7 = diy-modules:TEMP-HUM-SENSOR-DHT22: DHT22 - digital humidity & temperature sensor Also known as: AM2302 AM2302 datasheet available here: http://akizukidenshi.com/download/ds/aosong/AM2302.pdf Click here to find device on ebay.com <http://www.ebay.com/sch/dht22+digital+sensor>
USB1 = Seeed-Connector -2016:MICRO-USB-SMD(ZX62-B-5PA): 320010005; MPN: ZX62-B-5PA
Y2 = Seeed-Crystal Oscillator-2016:SMD-CRYSTAL-12MHZ-20PF-20PPM-40R(2P-5.0X3.2MM): 306010047; MPN: 5032/2P